# EasyEDA Pro project mt7621_integrated_router_v2.6_2025-04-17.epro, schematic Schematic1

## Sheets
1 PWR: Board Name: Board1; Create Date: 2025-03-22; Page Name: PWR; Project Name: mt7621_integrated_router; Schematic Name: Schematic1; Update Date: 2025-03-22; Company: 嘉立创EDA; Page Size: A4; Version: V1.0
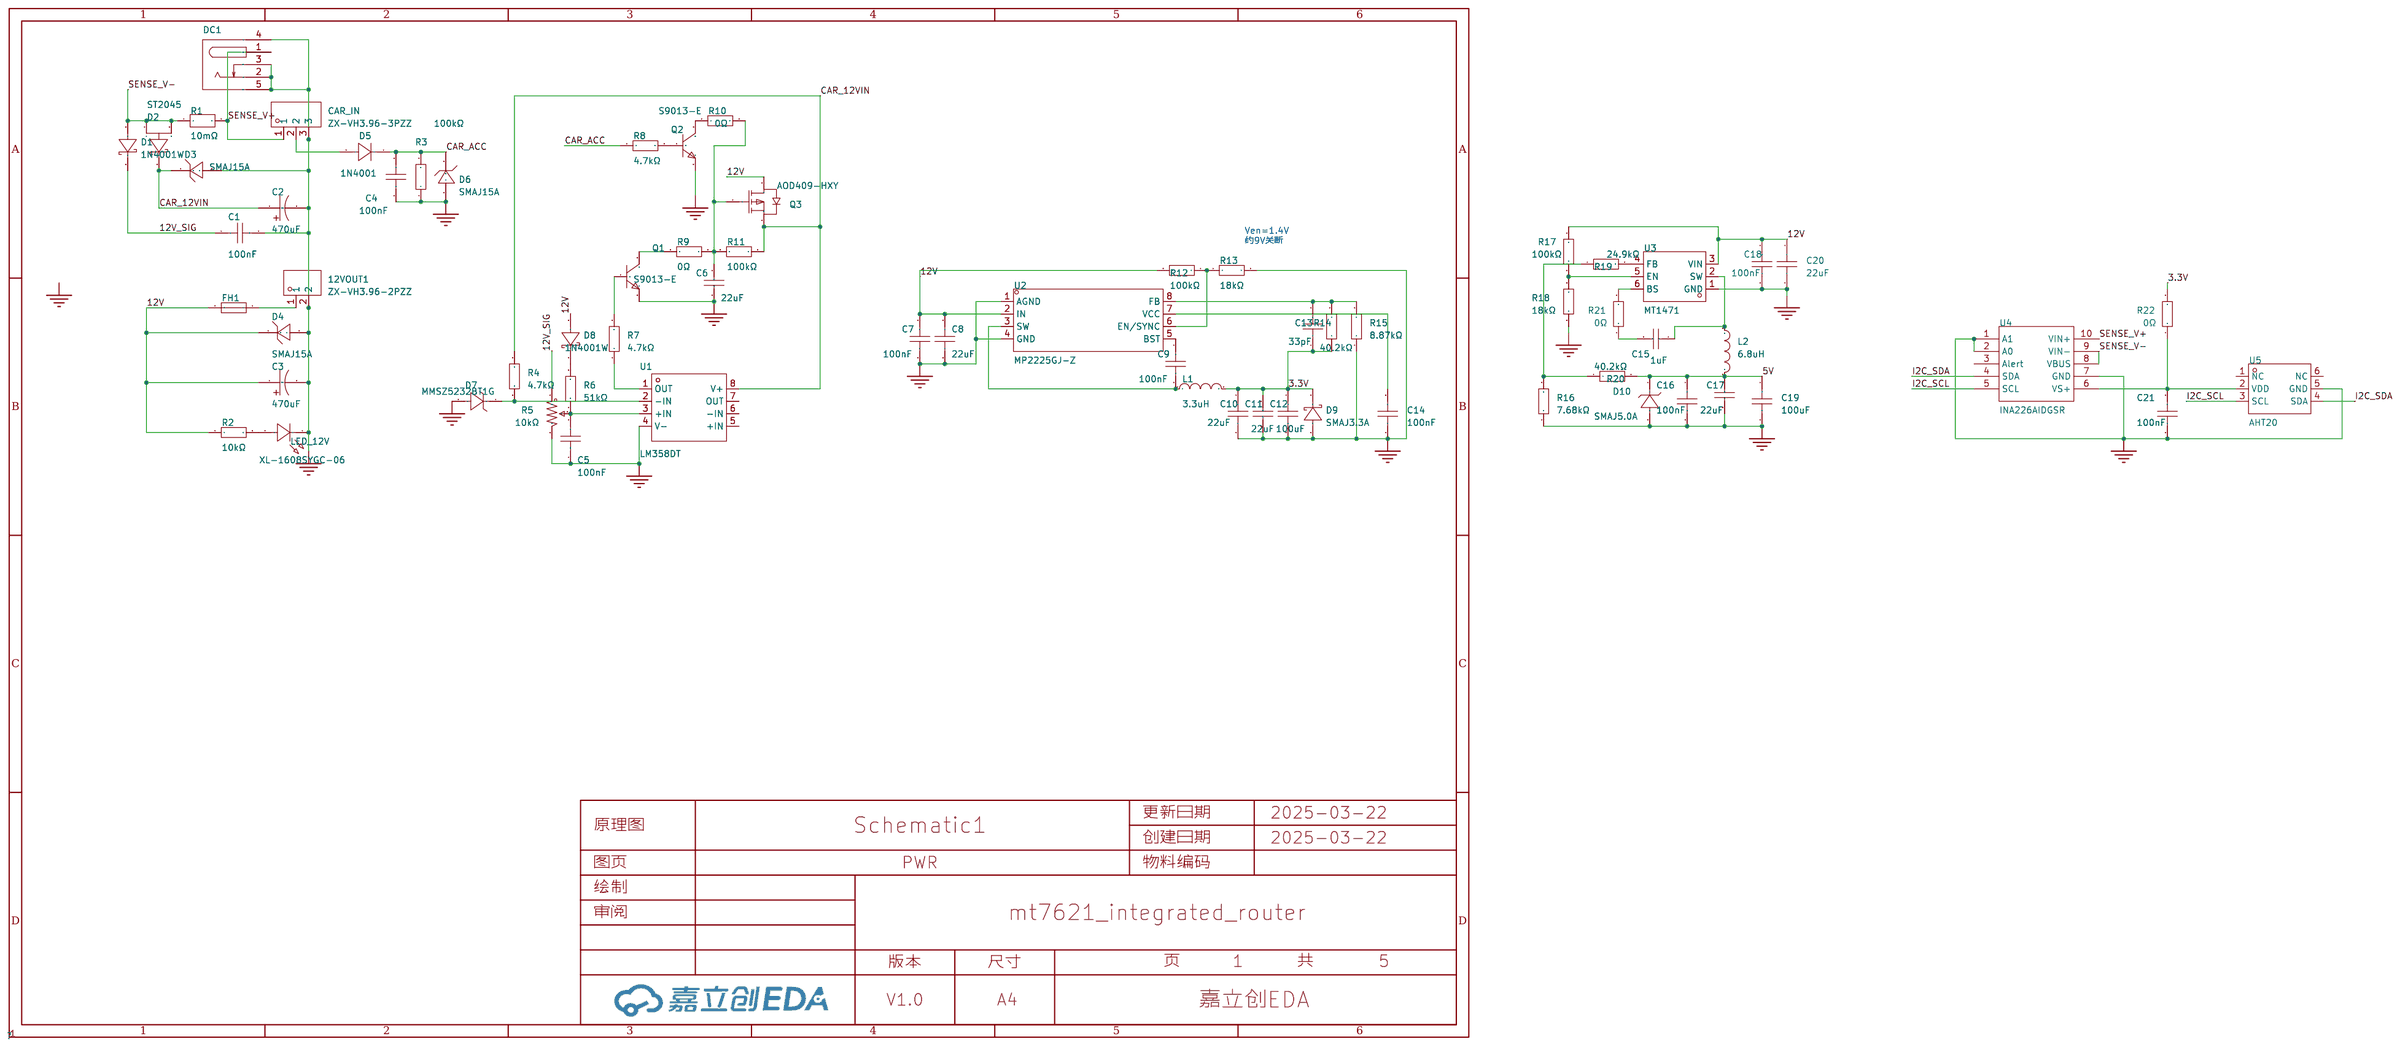
[diagram p0: PWR]
2 Router: Create Date: 2025-03-21; Page Name: Router; Update Date: 2025-03-21
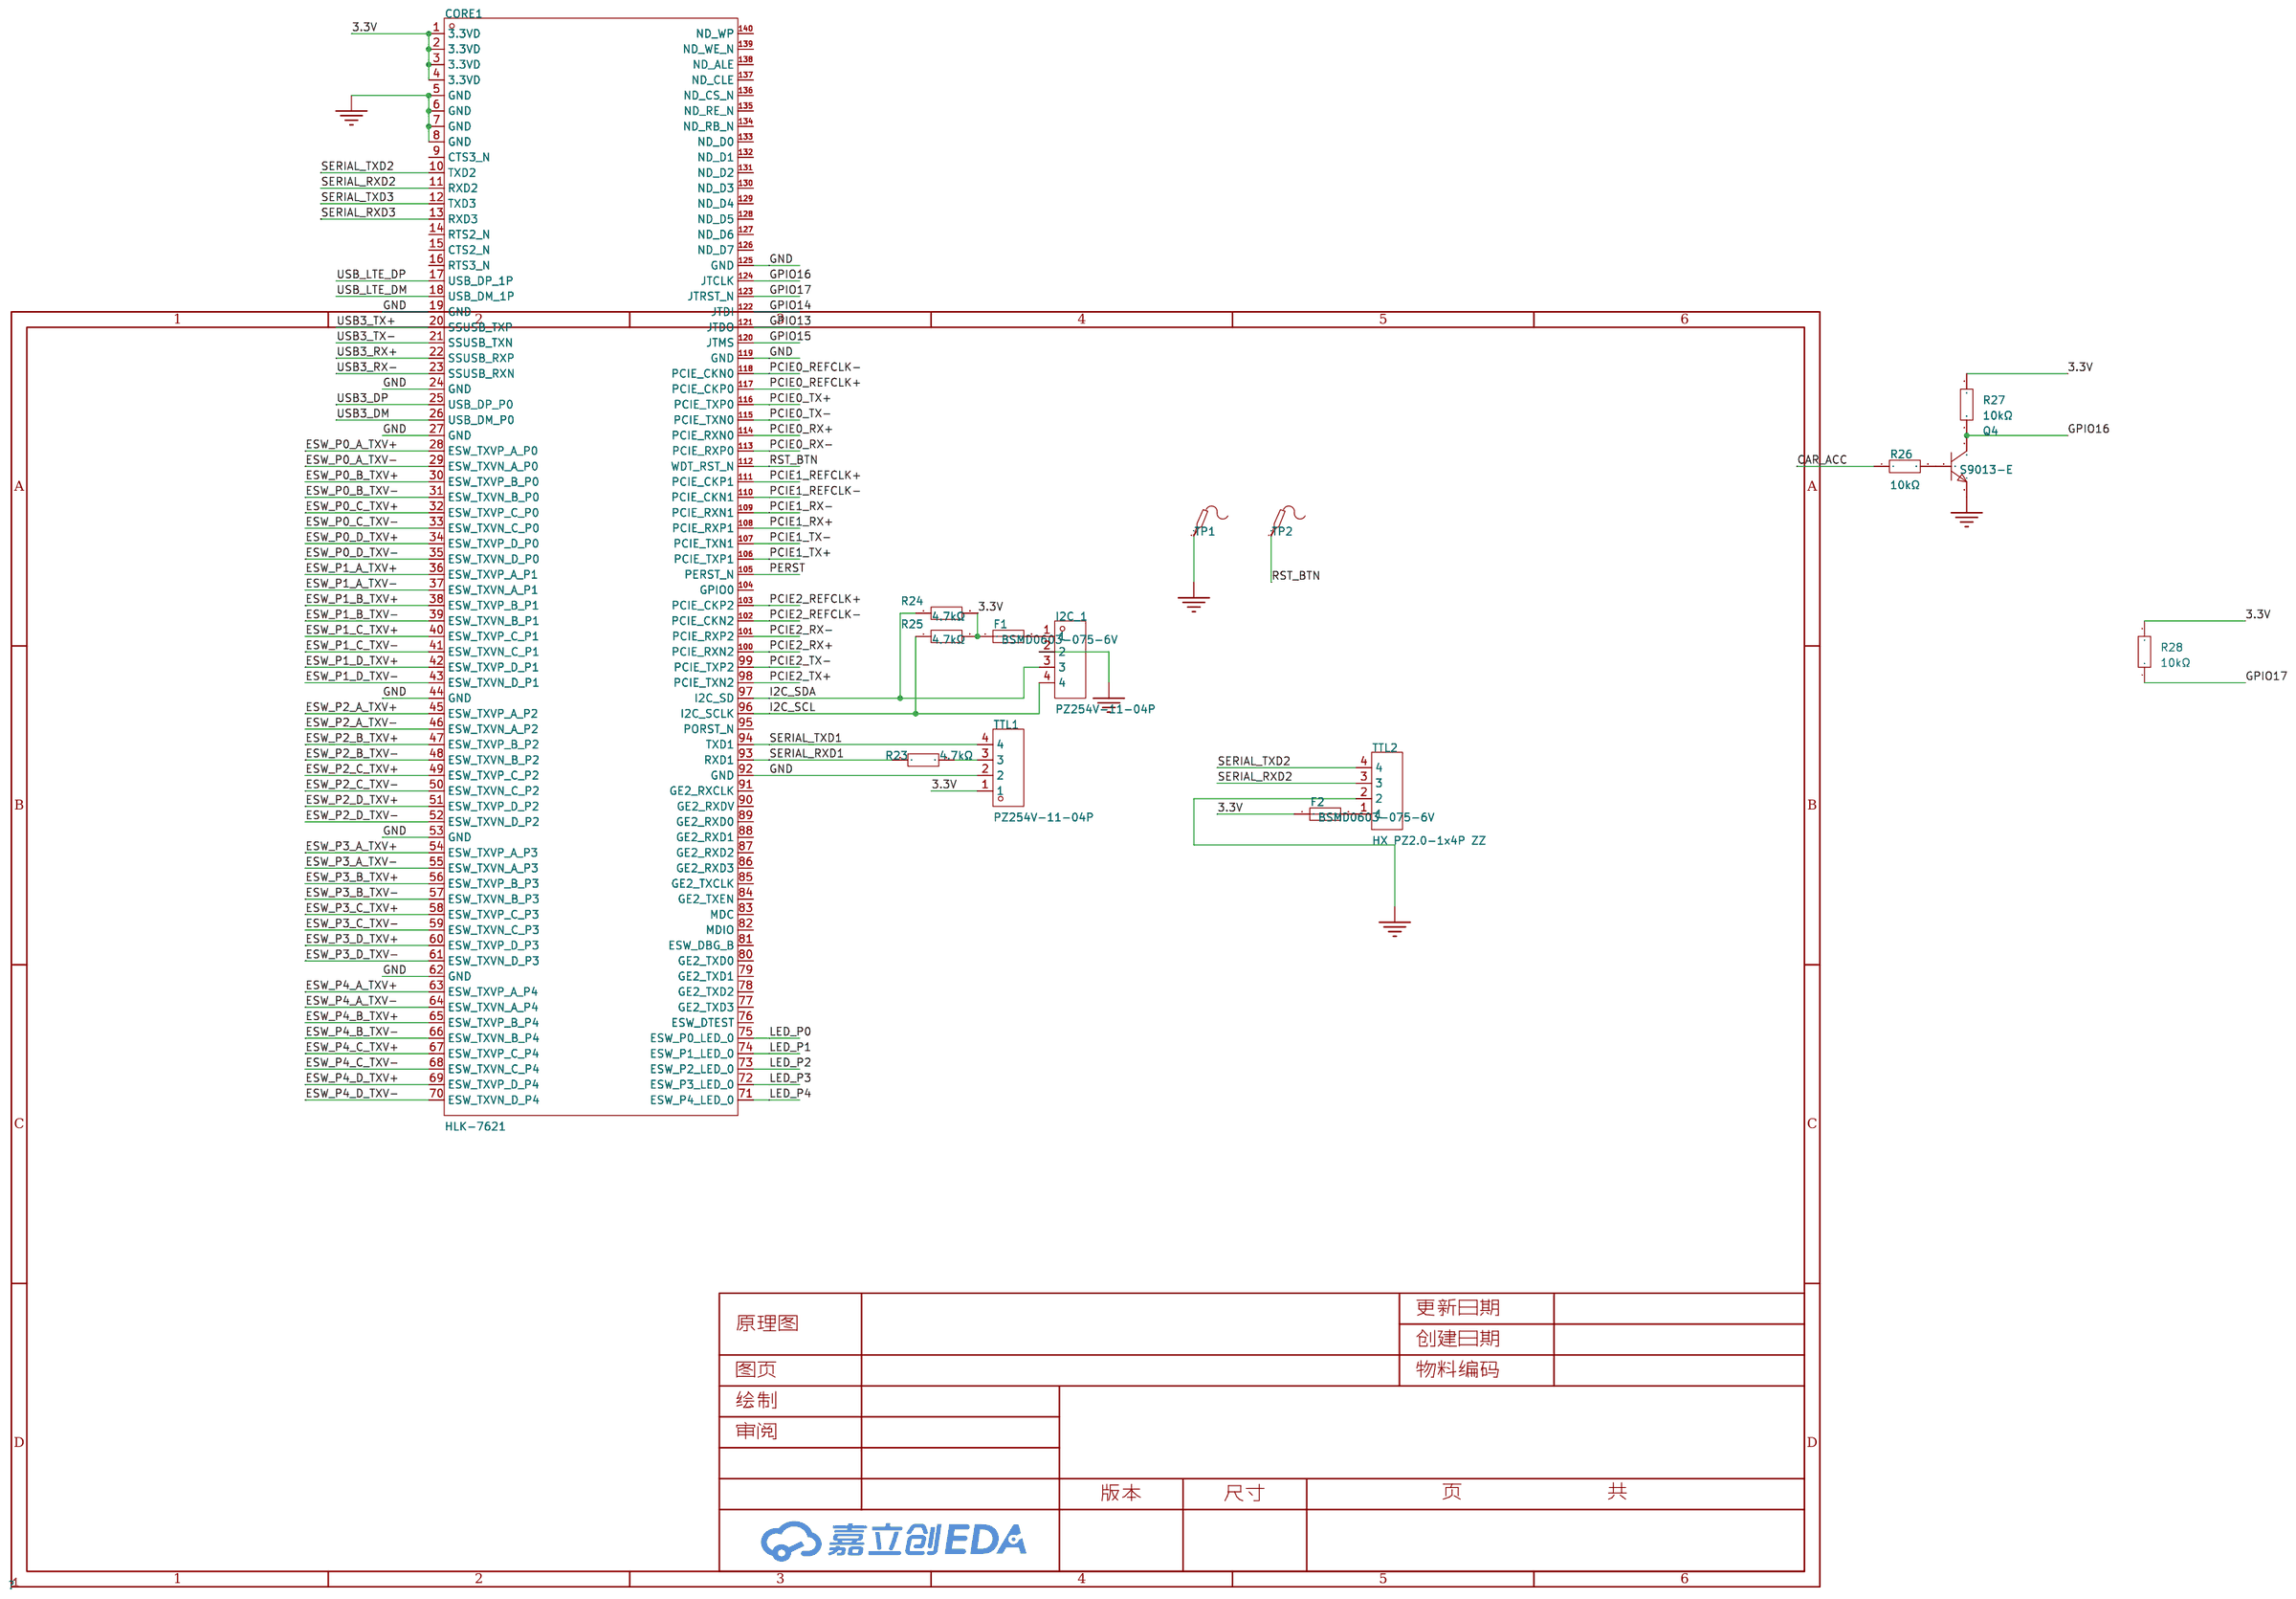
[diagram p1: Router]
3 PCIE: Create Date: 2025-02-01; Page Name: PCIE; Update Date: 2025-02-01
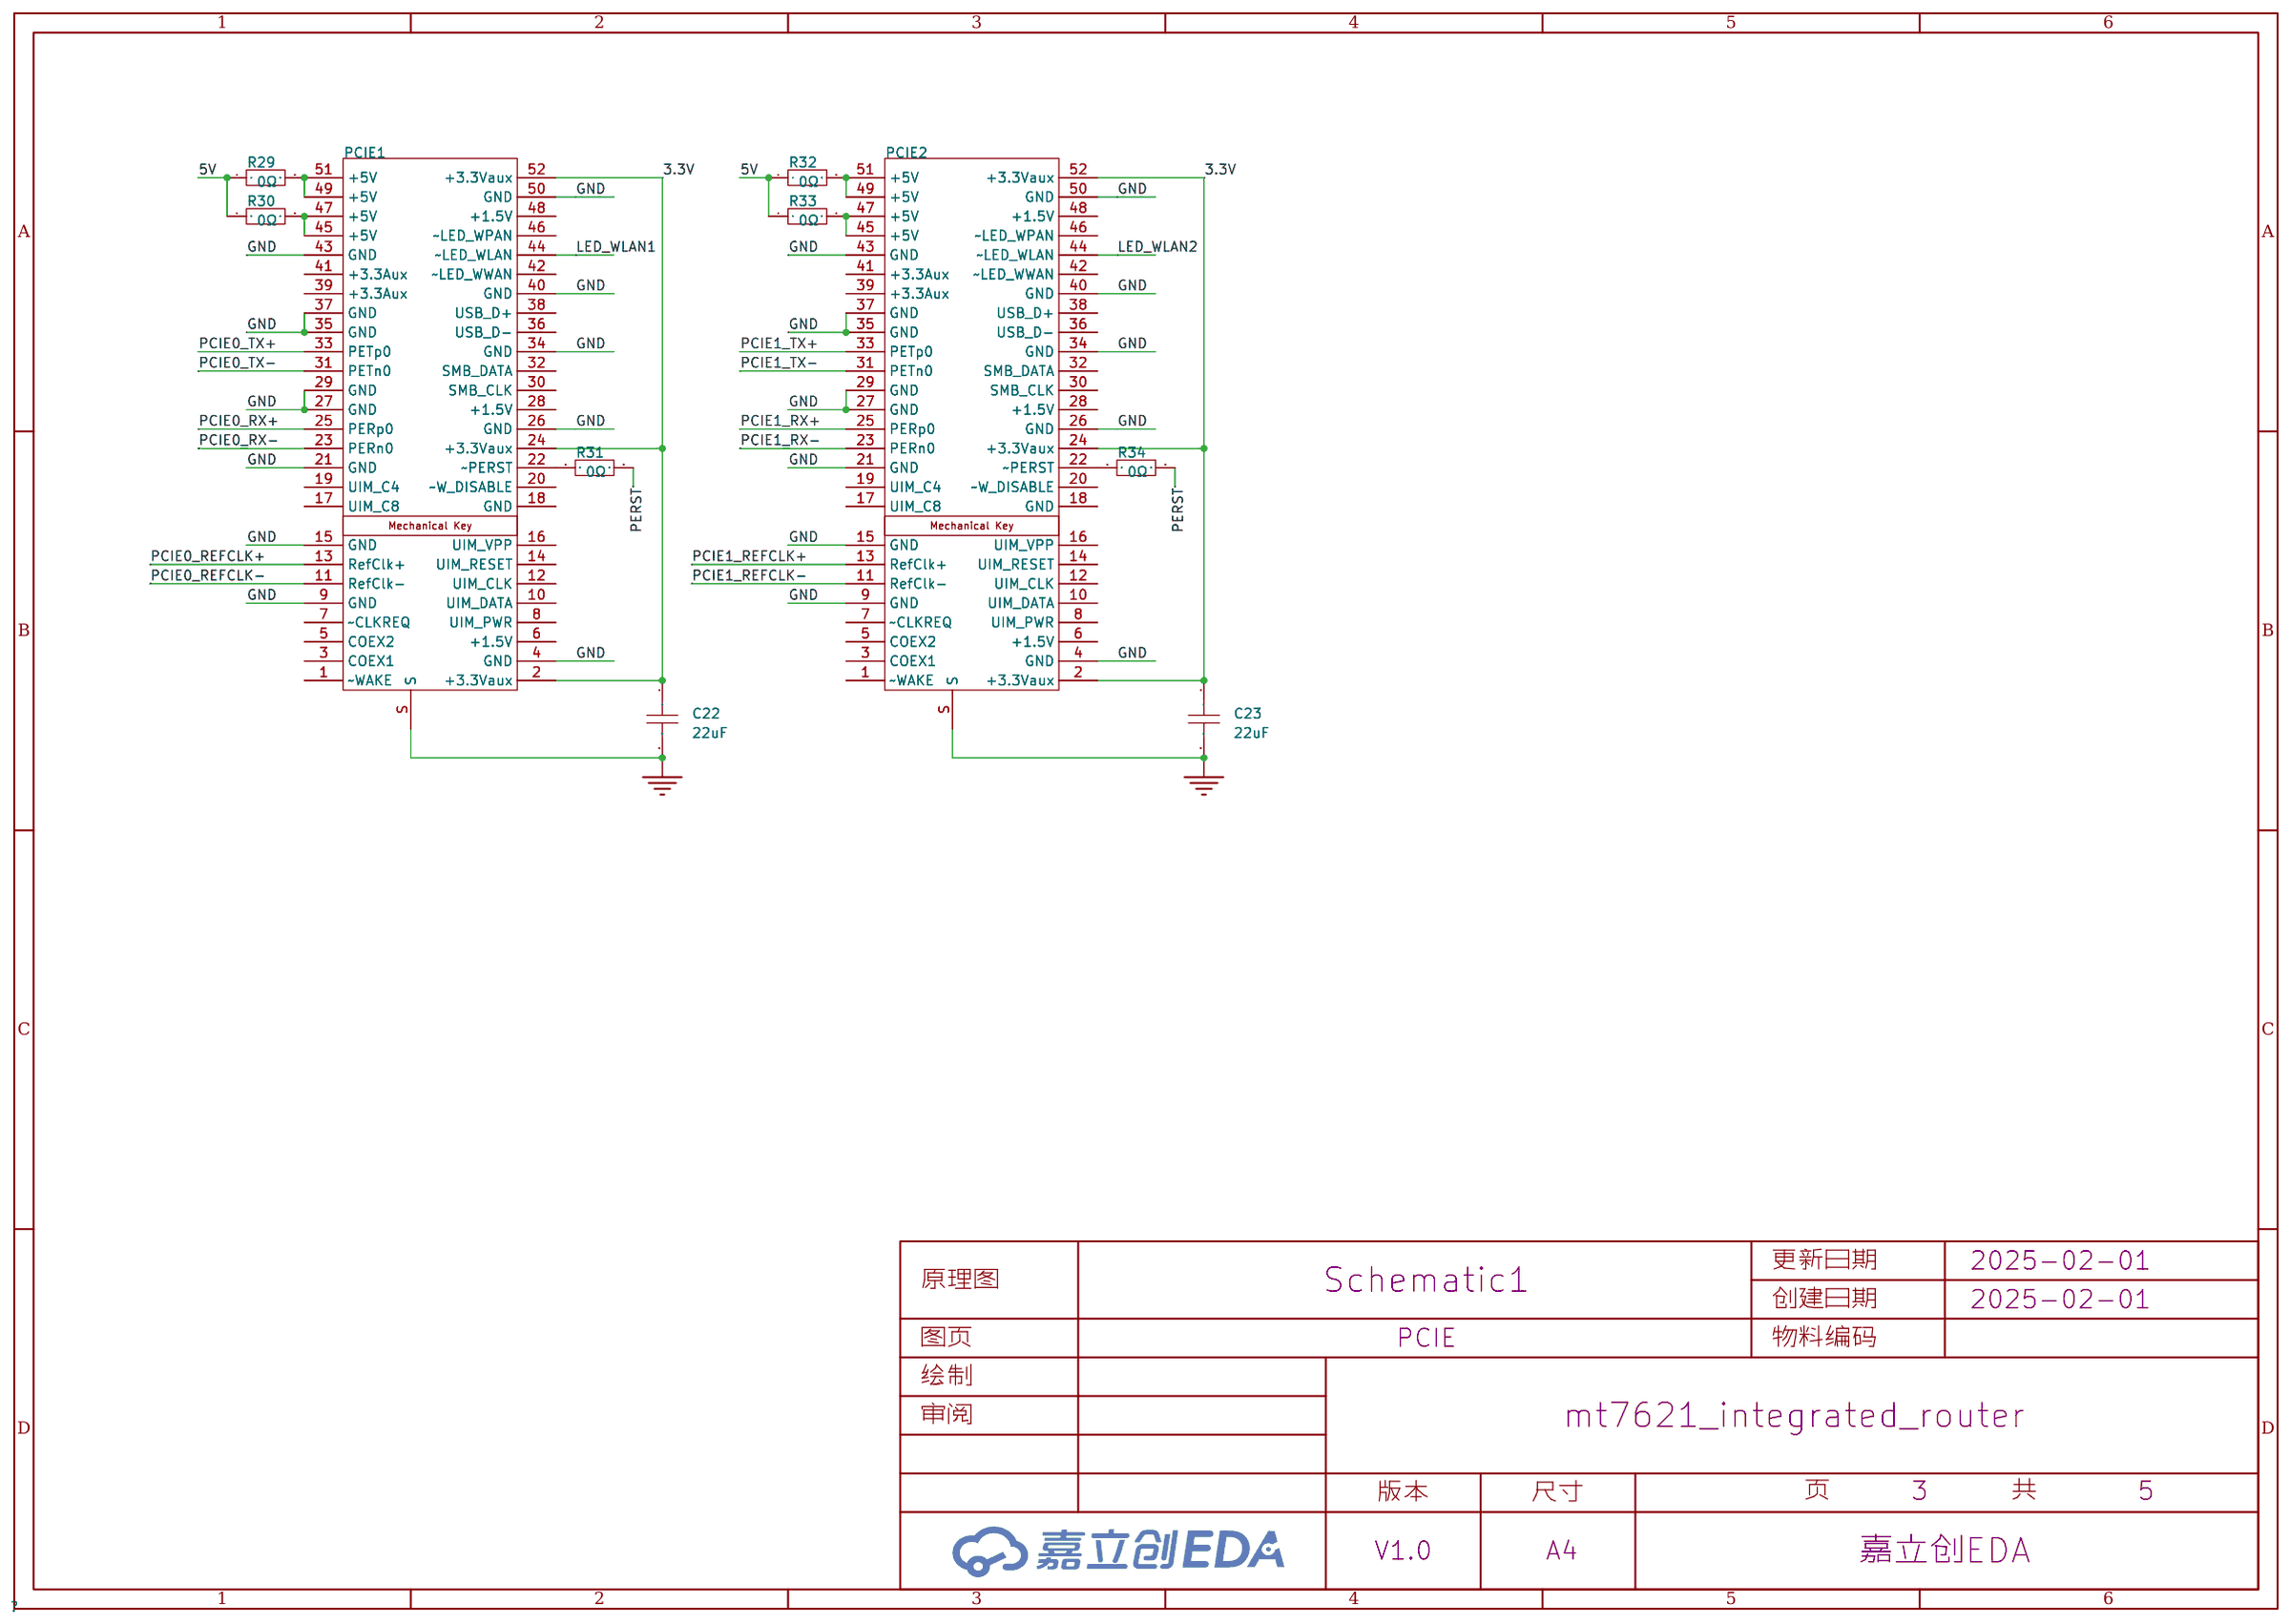
[diagram p2: PCIE]
4 LTE: Create Date: 2025-02-01; Page Name: LTE; Update Date: 2025-02-01
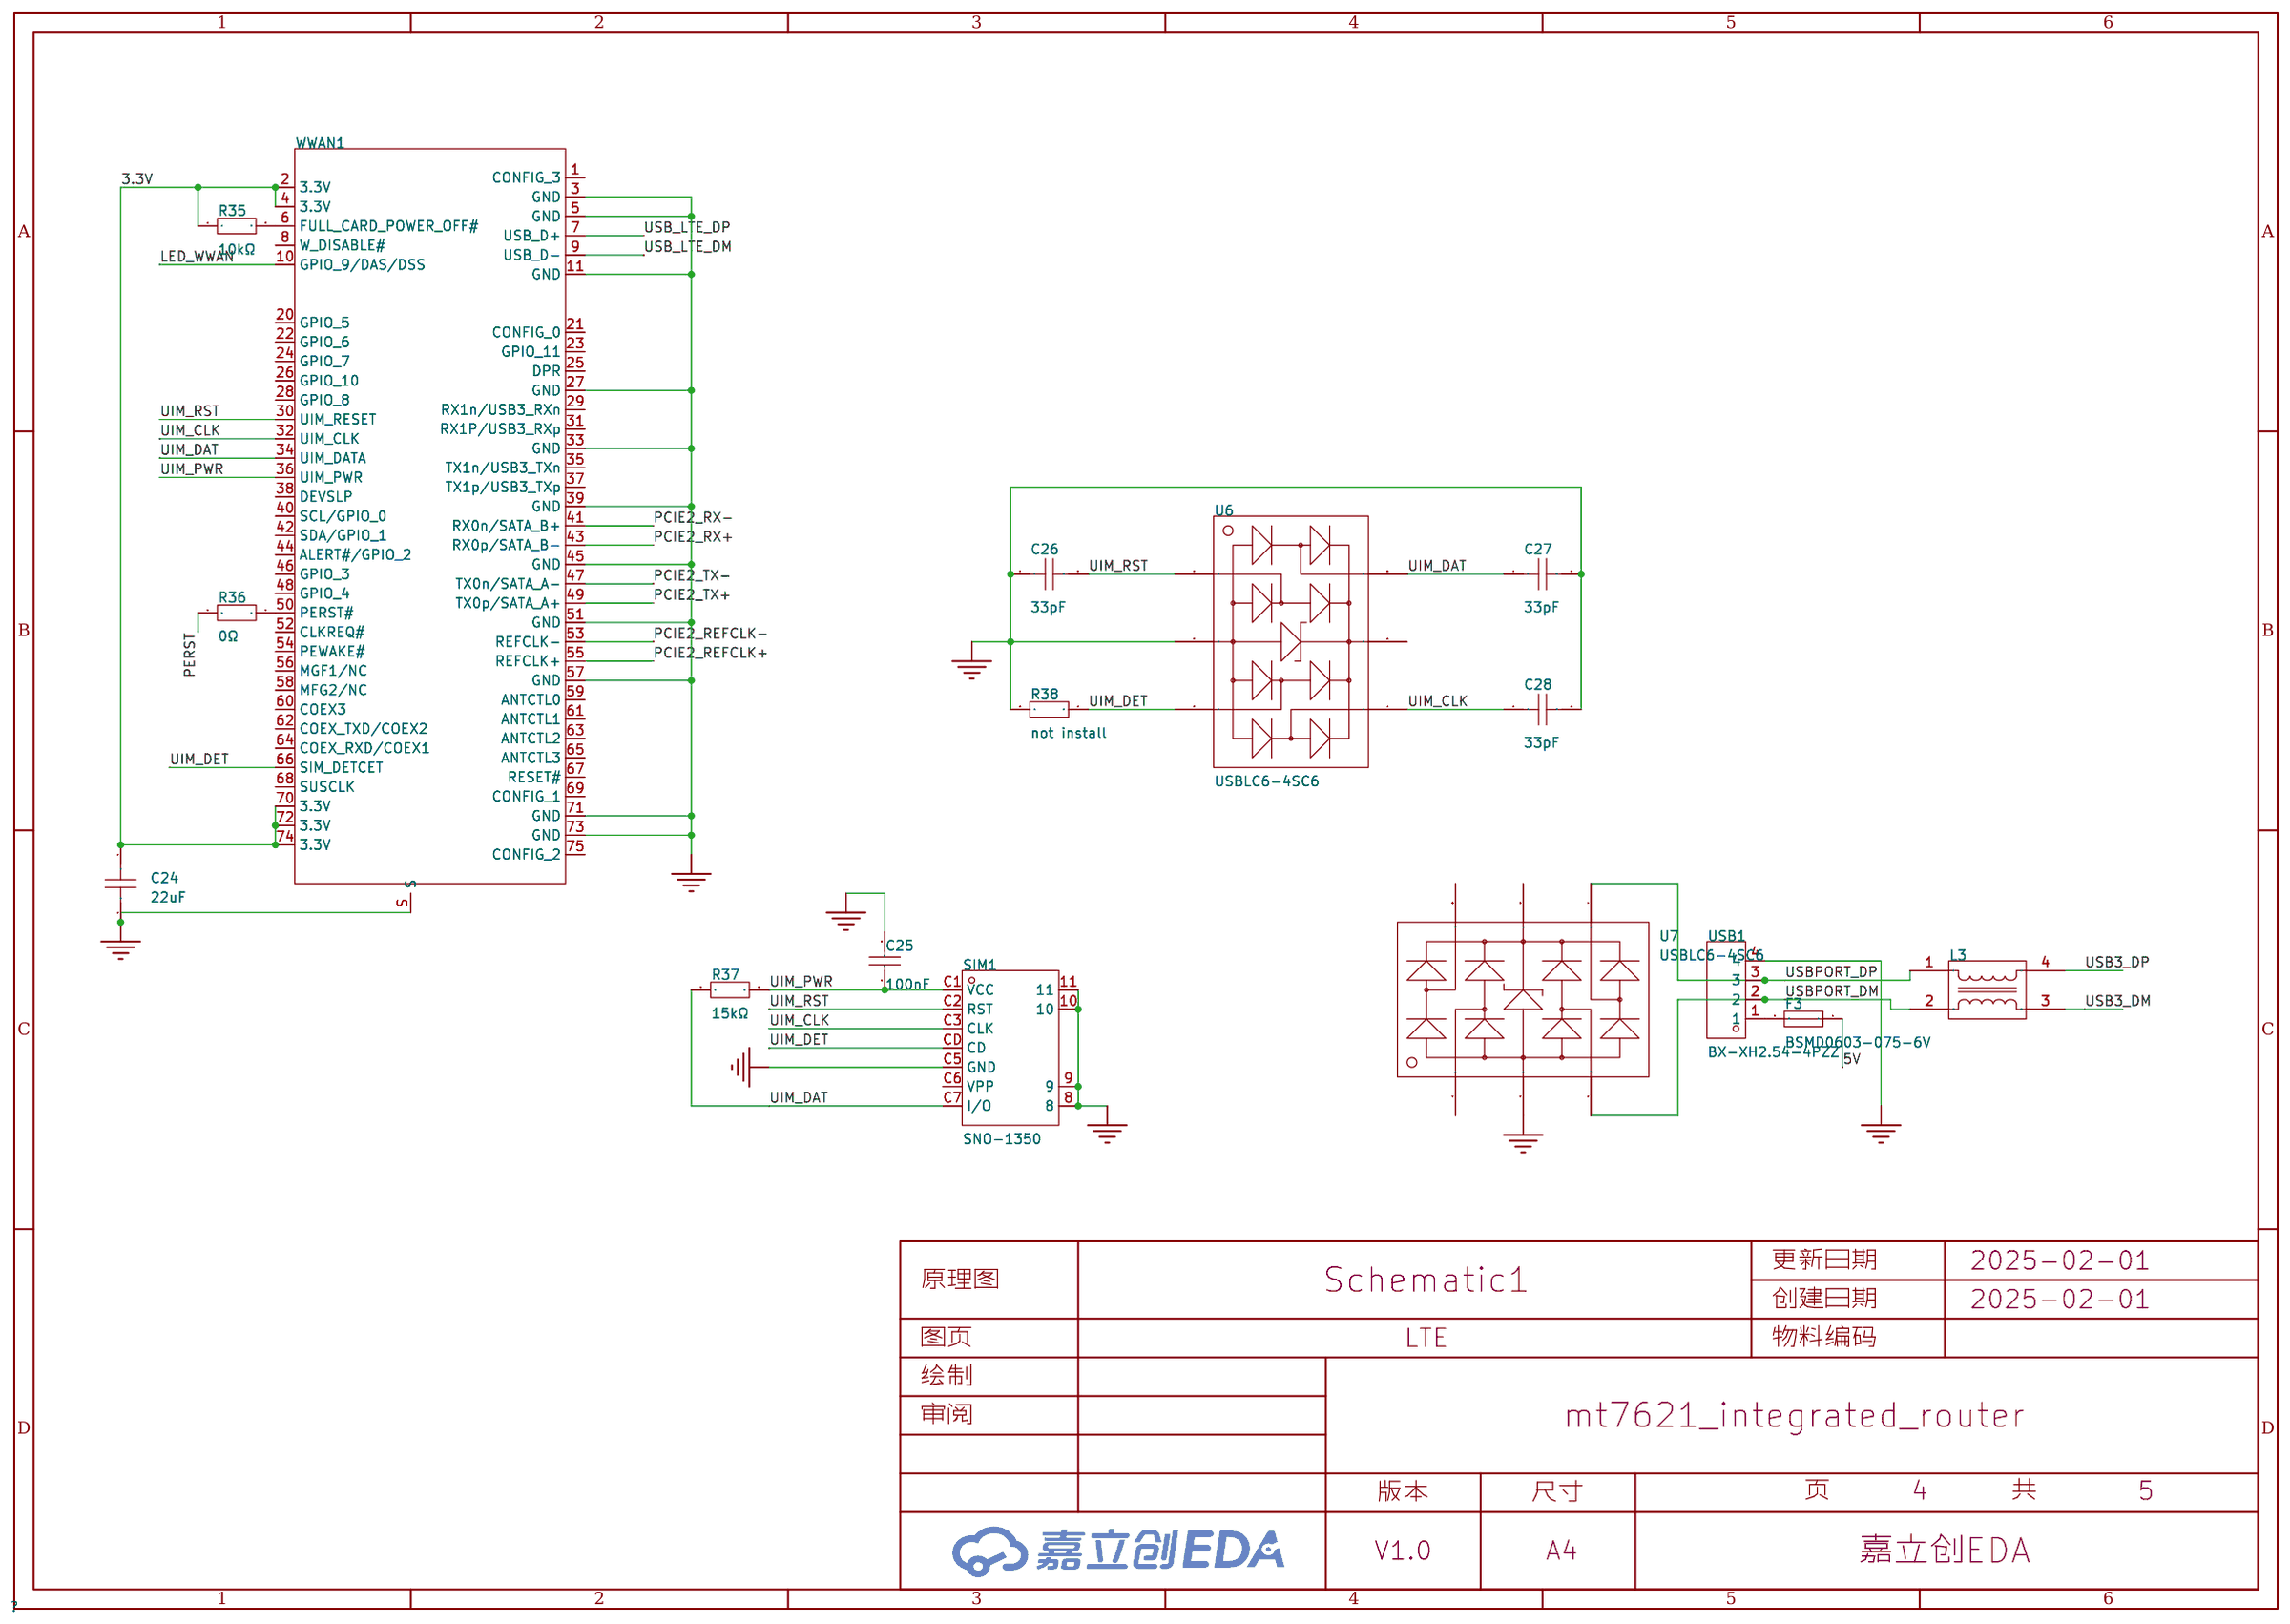
[diagram p3: LTE]
5 RJ45: Create Date: 2025-02-01; Page Name: RJ45; Update Date: 2025-03-17
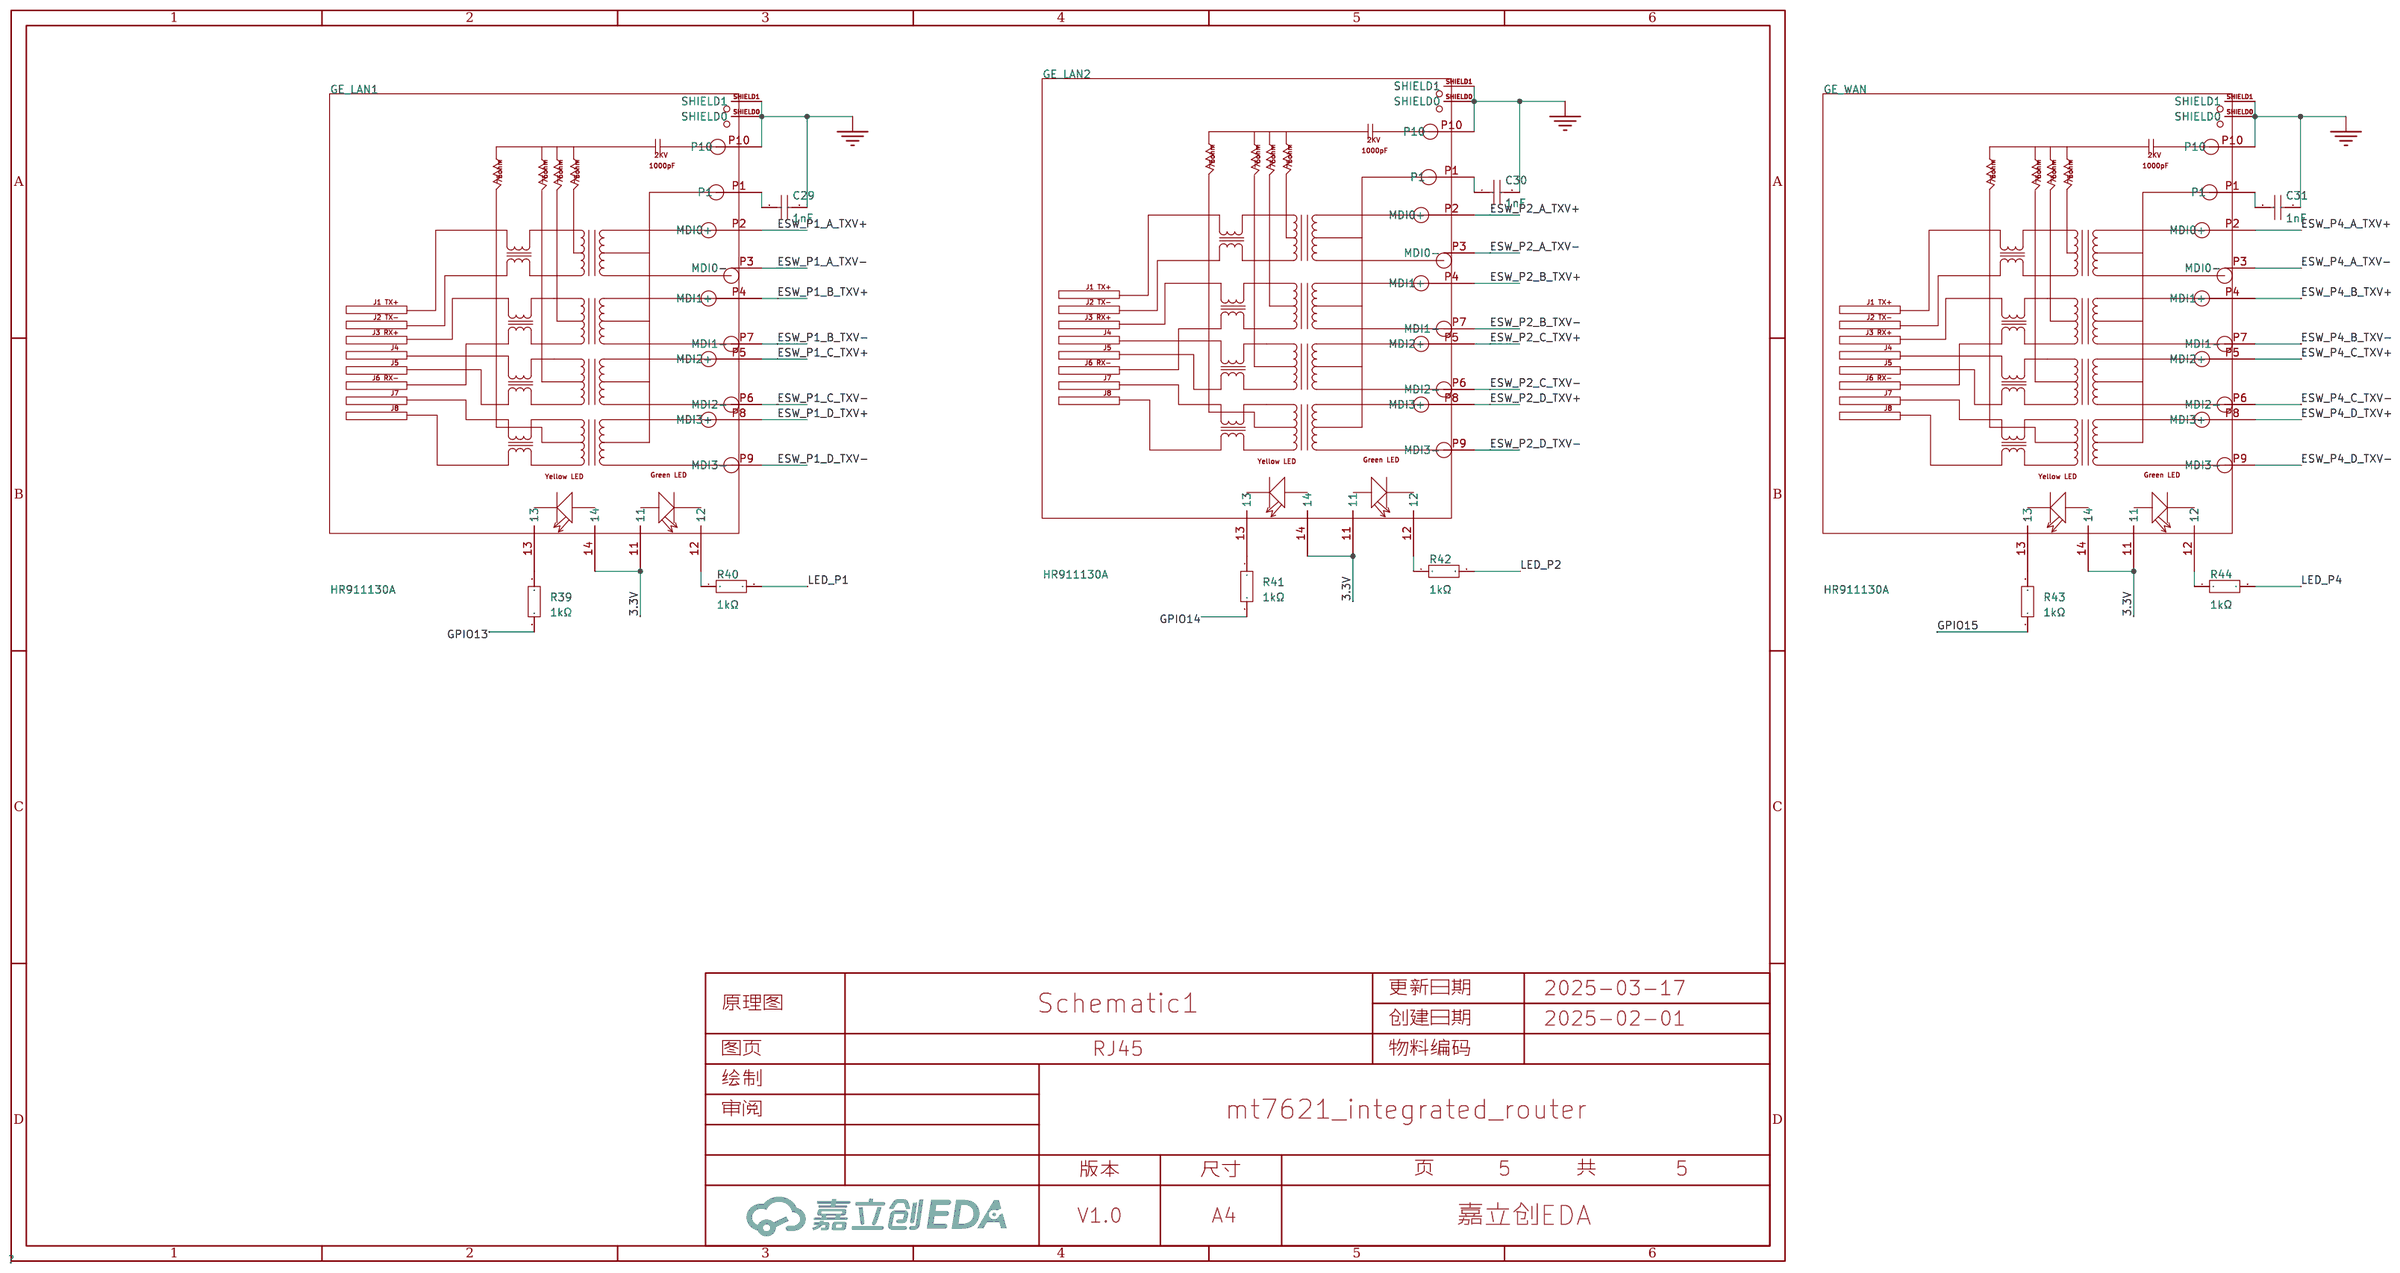
[diagram p4: RJ45]

## Parts
sheet LTE
C24  22uF  [C0805]
C25  100nF  [C0603]
C26  33pF  [C0603]
C27  33pF  [C0603]
C28  33pF  [C0603]
F3  BSMD0603-075-6V  [F0603]
L3  ACM2012-900-2P-T001  [FILTER-SMD_4P-L2.0-W1.2-TL_ACM2012E]
R35  10kΩ  [R0603]
R36  0Ω  [R0603]
R37  15kΩ  [R0603]
R38  not install  [R0603]
SIM1  SNO-1350  [SIM-SMD_SNO-1350]
U6  USBLC6-4SC6  [SOT-23-6_L2.9-W1.6-P0.95-LS2.8-BL]
U7  USBLC6-4SC6  [SOT-23-6_L2.9-W1.6-P0.95-LS2.8-BL]
USB1  BX-XH2.54-4PZZ  [CONN-TH_4P-P2.50_BX-XH2.54-4PZZ]
WWAN1  -  [NGFF_B_KEY_H3.2]
sheet PCIE
C22  22uF  [C0805]
C23  22uF  [C0805]
PCIE1  Mini-PCI-E_Socket_5V  [Mini_PCI-E_Socket]
PCIE2  Mini-PCI-E_Socket_5V  [Mini_PCI-E_Socket]
R29  0Ω  [R0603]
R30  0Ω  [R0603]
R31  0Ω  [R0603]
R32  0Ω  [R0603]
R33  0Ω  [R0603]
R34  0Ω  [R0603]
sheet PWR
12VOUT1  ZX-VH3.96-2PZZ  [CONN-TH_2P-P3.96_MEGASTAR_ZX-VH3.96-2PZZ]
C1  100nF  [C0603]
C2  470uF  [CAP-TH_BD8.0-P3.50-D0.6-FD]
C3  470uF  [CAP-TH_BD8.0-P3.50-D0.6-FD]
C4  100nF  [C0603]
C5  100nF  [C0603]
C6  22uF  [C0805]
C7  100nF  [C0603]
C8  22uF  [C0805]
C9  100nF  [C0603]
C10  22uF  [C0805]
C11  22uF  [C0805]
C12  100uF  [C1206]
C13  33pF  [C0603]
C14  100nF  [C0603]
C15  1uF  [C0603]
C16  100nF  [C0603]
C17  22uF  [C0805]
C18  100nF  [C0603]
C19  100uF  [C1206]
C20  22uF  [C0805]
C21  100nF  [C0603]
CAR_IN  ZX-VH3.96-3PZZ  [CONN-TH_3P-P3.96_MEGASTAR_ZX-VH3.96-3PZZ]
D1  1N4001W  [SOD-123FL_L2.7-W1.8-LS3.8-RD]
D2  ST2045  [TO-277_3P-L5.4-W4.0-LS6.5-BR]
D3  SMAJ15A  [SMA_L4.3-W2.6-LS5.2-RD]
D4  SMAJ15A  [SMA_L4.3-W2.6-LS5.2-RD]
D5  1N4001  [SMA_L4.3-W2.5-LS5.0-RD]
D6  SMAJ15A  [SMA_L4.3-W2.6-LS5.2-RD]
D7  MMSZ5232BT1G  [SOD-123_L2.7-W1.6-LS3.7-RD]
D8  1N4001W  [SOD-123FL_L2.7-W1.8-LS3.8-RD]
D9  SMAJ3.3A  [SMA-SMD_L4.4-W2.7-LS5.4-RD]
D10  SMAJ5.0A  [SMA_L4.3-W2.6-LS5.0-RD]
DC1  -  [DC-IN-TH_DC-044A-20A]
FH1  01550900M  [FUSE-SMD_L9.8-W5.0]
L1  3.3uH  [IND-SMD_L7.0-W6.6]
L2  6.8uH  [IND-SMD_L7.0-W6.6]
LED_12V  XL-1608SYGC-06  [LED0603-RD_GREEN]
Q1  S9013-E  [SOT-23-3_L2.9-W1.3-P1.90-LS2.4-BR]
Q2  S9013-E  [SOT-23-3_L2.9-W1.3-P1.90-LS2.4-BR]
Q3  AOD409-HXY  [TO-252-2_L6.6-W6.1-P4.57-LS9.9-TL-CW]
R1  10mΩ  [R1206]
R2  10kΩ  [R0603]
R3  100kΩ  [R0603]
R4  4.7kΩ  [R0603]
R5  10kΩ  [RES-ADJ-TH_3P-L10.0-W10.0-P2.50-L]
R6  51kΩ  [R0603]
R7  4.7kΩ  [R0603]
R8  4.7kΩ  [R0603]
R9  0Ω  [R0603]
R10  0Ω  [R0603]
R11  100kΩ  [R0603]
R12  100kΩ  [R0603]
R13  18kΩ  [R0603]
R14  40.2kΩ  [R0603]
R15  8.87kΩ  [R0603]
R16  7.68kΩ  [R0603]
R17  100kΩ  [R0603]
R18  18kΩ  [R0603]
R19  24.9kΩ  [R0603]
R20  40.2kΩ  [R0603]
R21  0Ω  [R0603]
R22  0Ω  [R0603]
U1  LM358DT  [SOIC-8_L5.0-W4.0-P1.27-LS6.0-BL]
U2  MP2225GJ-Z  [TSOT-23-8_L2.9-W1.6-P0.65-LS2.8-BR]
U3  MT1471  [SOT-23-6_L2.9-W1.6-P0.95-LS2.8-BR]
U4  INA226AIDGSR  [MSOP-10_L3.0-W3.0-P0.50-LS5.0-BL]
U5  AHT20  [SENSOR-SMD_L3.0-W3.0-P1.00-BR]
sheet RJ45
C29  1nF  [C0603]
C30  1nF  [C0603]
C31  1nF  [C0603]
GE_LAN1  HR911130A  [RJ45-TH_HR911130A]
GE_LAN2  HR911130A  [RJ45-TH_HR911130A]
GE_WAN  HR911130A  [RJ45-TH_HR911130A]
R39  1kΩ  [R0603]
R40  1kΩ  [R0603]
R41  1kΩ  [R0603]
R42  1kΩ  [R0603]
R43  1kΩ  [R0603]
R44  1kΩ  [R0603]
sheet Router
CORE1  HLK-7621  [COMM-SMD_HLK-7621]
F1  BSMD0603-075-6V  [F0603]
F2  BSMD0603-075-6V  [F0603]
I2C_1  PZ254V-11-04P  [HDR-TH_4P-P2.54-V-M]
Q4  S9013-E  [SOT-23-3_L2.9-W1.3-P1.90-LS2.4-BR]
R23  4.7kΩ  [R0603]
R24  4.7kΩ  [R0603]
R25  4.7kΩ  [R0603]
R26  10kΩ  [R0603]
R27  10kΩ  [R0603]
R28  10kΩ  [R0603]
TP1  -  [Test-Point-0.5mm]
TP2  -  [Test-Point-0.5mm]
TTL1  PZ254V-11-04P  [HDR-TH_4P-P2.54-V-M]
TTL2  HX PZ2.0-1x4P ZZ  [HDR-TH_4P-P2.00-V-M-3]

## Library data of the parts
C6 C8 C10 C11 C17 C20 C22-C24 = CC0805MKX5R7BB226: 容值:22uF;精度:±20%;额定电压:16V;材质(温度系数):X5R;; LCSC Part Name: 22uF ±20% 16V; Supplier Part: C128856; Manufacturer: YAGEO(国巨); Supplier Footprint: 0805; JLCPCB Part Class: Extended Part; Datasheet: https://atta.szlcsc.com/upload/public/pdf/source/20200619/C128856_2FCFBA051414242A35F1817523308144.pdf; Supplier: LCSC; Tolerance: ±20%; Voltage Rated: 16V; Temperature Coefficient: X5R
C7 C9 C16 C18 C21 C25 = CL10B104KA8NNNC: 容值:100nF;精度:±10%;额定电压:25V;材质(温度系数):X7R;; LCSC Part Name: 100nF ±10% 25V; Supplier Part: C1590; Manufacturer: SAMSUNG(三星); Supplier Footprint: 0603; JLCPCB Part Class: Extended Part; Datasheet: https://atta.szlcsc.com/upload/public/pdf/source/20160103/1457707680294.pdf; Supplier: LCSC; Tolerance: ±10%; Voltage Rated: 25V; Temperature Coefficient: X7R
C13 C26-C28 = 0603CG330J500NT: 容值:33pF;精度:±5%;额定电压:50V;材质(温度系数):C0G;; LCSC Part Name: 33pF ±5% 50V; Supplier Part: C91368; Manufacturer: FH(风华); Supplier Footprint: 0603; JLCPCB Part Class: 扩展库; Datasheet: https://atta.szlcsc.com/upload/public/pdf/source/20170923/C91368_1506149566728988976.pdf; Supplier: LCSC; Tolerance: ±5%; Voltage Rated: 50V; Temperature Coefficient: C0G
F1-F3 = BSMD0603-075-6V: 最大电压:6V;最大电流:40A;保持电流:750mA;跳闸电流:1.5A;; LCSC Part Name: 6V 750mA 0603自恢复; Supplier Part: C914092; Manufacturer: BHFUSE(佰宏); Supplier Footprint: 0603; JLCPCB Part Class: Extended Part; Datasheet: https://atta.szlcsc.com/upload/public/pdf/source/20230512/E478DE3555A0061DA0124A9F45802B86.pdf; Supplier: LCSC; Operating Voltage (Max): 6V; Current Rating (Max): 40A; Hold Current: 750mA; Trip Current: 1.5A; Power Dissipation: 500mW; Resistance - Initial (Ri) (Min): 60mΩ; Resistance - Post Trip (R1) (Max): 450mΩ; Maximum Time to Trip: 100ms; Operating Temperature: -40℃~+85℃
L3 = ACM2012-900-2P-T001: 线路数:2;阻抗 @ 频率:90Ω@100MHz;直流电阻(DCR):190mΩ;; LCSC Part Name: 两路 贴片共模滤波器 阻抗90Ω@100MHz; Supplier Part: C307642; Manufacturer: TDK; Supplier Footprint: SMD,2X1.2x1.3mm; JLCPCB Part Class: 扩展库; Datasheet: https://atta.szlcsc.com/upload/public/pdf/source/20190722/C404375_4B4DF30A3263EFA7EC5B48E25B1E7F7A.pdf; Supplier: LCSC; Number of Lines: 2; Withstanding Voltage: 600V; Current Rating: 400mA; Voltage Rating - DC: 50V; Impedance @ Frequency: 90Ω@100MHz; DC Resistance (DCR): 190mΩ; Operating Temperature: -40℃~+105℃
R2 R26-R28 R35 = 0603WAF1002T5E: 电阻类型:厚膜电阻;阻值:10kΩ;精度:±1%;功率:100mW;; LCSC Part Name: 厚膜电阻 10kΩ ±1% 100mW; Supplier Part: C25804; Manufacturer: UNI-ROYAL(厚声); Supplier Footprint: 0603; JLCPCB Part Class: 基础库; Datasheet: https://atta.szlcsc.com/upload/public/pdf/source/20200306/C422600_1E6D84923E4A46A82E41ADD87F860B5C.pdf; Supplier: LCSC; Type: 厚膜电阻; Tolerance: ±1%; Power(Watts): 100mW; Temperature Coefficient: ±100ppm/℃; Overload Voltage (Max): 75V; Operating Temperature Range: -55℃~+155℃
R9 R10 R21 R22 R29-R34 R36 = 0603WAF0000T5E: 电阻类型:厚膜电阻;阻值:0Ω;精度:±1%;功率:100mW;; LCSC Part Name: 0Ω ±1% 100mW; Supplier Part: C21189; Manufacturer: UNI-ROYAL(厚声); Supplier Footprint: 0603; JLCPCB Part Class: 基础库; Datasheet: https://atta.szlcsc.com/upload/public/pdf/source/20200306/C422600_1E6D84923E4A46A82E41ADD87F860B5C.pdf; Supplier: LCSC; Type: 厚膜电阻; Tolerance: ±1%; Power(Watts): 100mW; Overload Voltage (Max): 75V; Operating Temperature Range: -55℃~+155℃
R37 = AC0603FR-0715KL: 电阻类型:厚膜电阻;阻值:15kΩ;精度:±1%;功率:100mW;; LCSC Part Name: 15kΩ ±1% 100mW; Supplier Part: C125928; Manufacturer: YAGEO(国巨); Supplier Footprint: 0603; JLCPCB Part Class: 扩展库; Datasheet: https://atta.szlcsc.com/upload/public/pdf/source/20171221/C125928_15138310091971195203.pdf; Supplier: LCSC; Type: 厚膜电阻; Tolerance: ±1%; Power(Watts): 100mW; Temperature Coefficient: ±100ppm/℃; Overload Voltage (Max): 75V; Operating Temperature Range: -55℃~+155℃
R38 = RC0603FR-0733KL: 电阻类型:厚膜电阻;阻值:33kΩ;精度:±1%;功率:100mW;; LCSC Part Name: 33kΩ ±1% 100mW; Supplier Part: C126359; Manufacturer: YAGEO(国巨); Supplier Footprint: 0603; JLCPCB Part Class: 扩展库; Datasheet: https://atta.szlcsc.com/upload/public/pdf/source/20170818/C126359_1503051263039895297.pdf; Supplier: LCSC; Type: 厚膜电阻; Tolerance: ±1%; Power(Watts): 100mW; Temperature Coefficient: ±100ppm/℃; Overload Voltage (Max): 75V; Operating Temperature Range: -55℃~+155℃
SIM1 = SNO-1350: 触头材质:-;卡连接方式:-;触头镀层:-;连接器类型:-;卡类型:-;; Supplier Part: C410358; Manufacturer: HANBO(汉博); Supplier Footprint: SMD; JLCPCB Part Class: 扩展库; Datasheet: https://atta.szlcsc.com/upload/public/pdf/source/20210810/0F59696A76593C5ED7E633075788D5BB.pdf; Supplier: LCSC
U6 U7 = USBLC6-4SC6_C5197386: Supplier Part: C5197386; Manufacturer: TECH PUBLIC(台舟); Supplier Footprint: SOT-23-6; JLCPCB Part Class: 扩展库; Datasheet: https://atta.szlcsc.com/upload/public/pdf/source/20221013/DA7C9D2E1699C4B4277AD0F5036C296E.pdf; Supplier: LCSC
USB1 = BX-XH2.54-4PZZ: 插针结构:1x4P;间距:2.54mm;安装方式:直插;参考系列:XH;总PIN数:4P;排数:1;每排PIN数:4;行距:-;额定电流:3A;触头材质:黄铜;触头镀层:锡;工作温度范围:-25℃~+85℃;; Supplier Part: C18077835; Manufacturer: Bossie(博锡); Supplier Footprint: 插件,P=2.54mm; JLCPCB Part Class: 扩展库; Datasheet: https://atta.szlcsc.com/upload/public/pdf/source/20231017/5821079C87ACB6AB664C681F6F628D03.pdf; Supplier: LCSC; Pins Structure: 1x4P; Pitch: 2.54mm; Mounting Style: 直插; Reference Series: XH; Number of Pins: 4P; Number of Rows: 1; Number of PINs Per Row: 4; Current Rating (Max): 3A; Contact Material: 黄铜; Contact Plating: 锡; Operating Temperature Range: -25℃~+85℃
WWAN1 = NGFF_B_KEY_H3.2: Check: false
PCIE1 PCIE2 = Mini-PCI-E_Socket_5V
12VOUT1 = ZX-VH3.96-2PZZ: 插针结构:1x2P;间距:3.96mm;安装方式:直插;参考系列:VH;总PIN数:2P;排数:1;每排PIN数:2;行距:-;额定电流:3A;触头材质:黄铜;触头镀层:锡;工作温度范围:-;; LCSC Part Name: 1x2P 间距:3.96mm 直插 系列:VH; Supplier Part: C7429660; Manufacturer: Megastar(兆星); Supplier Footprint: 插件,P=3.96mm; JLCPCB Part Class: 扩展库; Datasheet: https://atta.szlcsc.com/upload/public/pdf/source/20230619/B0F65C0388219DF8CB89B38B943D83C5.pdf; Supplier: LCSC; Pins Structure: 1x2P; Pitch: 3.96mm; Mounting Type: 直插; Reference Series: VH; Number of Pins: 2P; Number of Rows: 1; Number of PINs Per Row: 2; Current Rating: 3A; Contact Material: 黄铜; Contact Plating: 锡; Voltage Rating: 250V; Plastic Material: PA66; Flame Retardant Rating: UL94V-0; Color: 白色; X-Length of Bottom Edge on Board (Spacing Line): 7.92mm; Y-Width of Bottom Edge on Board: 7.9mm
C1 C4 C5 = CL10B104KA8NNNC: 容值:100nF;精度:±10%;额定电压:25V;材质(温度系数):X7R;; LCSC Part Name: 100nF ±10% 25V; Supplier Part: C1590; Manufacturer: SAMSUNG(三星); Supplier Footprint: 0603; JLCPCB Part Class: 扩展库; Datasheet: https://atta.szlcsc.com/upload/public/pdf/source/20160103/1457707680294.pdf; Supplier: LCSC; Tolerance: ±10%; Voltage Rated: 25V; Temperature Coefficient: X7R
C2 C3 = 16SEPG470M: 类型:聚合物;容值:470uF;精度:±20%;额定电压:16V;纹波电流:5.4A@100kHz;等效串联电阻:8mΩ@100kHz;; LCSC Part Name: 470uF±20%16V; Supplier Part: C403795; Manufacturer: PANASONIC(松下); Supplier Footprint: 插件,8x8.9mm; JLCPCB Part Class: ExtendedPart; Datasheet: https://atta.szlcsc.com/upload/public/pdf/source/20190712/C403795_C9CFFC89EE1BDDAC56CB480764CE2283.pdf; Supplier: LCSC; Type: 聚合物; Tolerance: ±20%; Rated Voltage: 16V; φD: 8mm; L: 8.9mm; Lead Spacing: 3.5mm; Ripple Current: 5.4A@100kHz; Equivalent Series Resistance(ESR): 8mΩ@100kHz; Lifetime @ Temp: 5000hrs@105℃; Operating Temperature: -55℃~+105℃
C12 C19 = GRM31CR61A107ME05L: 容值:100uF;精度:±20%;额定电压:10V;材质(温度系数):X5R;; LCSC Part Name: 100uF ±20% 10V; Supplier Part: C312983; Manufacturer: muRata(村田); Supplier Footprint: 1206; JLCPCB Part Class: Extended Part; Datasheet: https://atta.szlcsc.com/upload/public/pdf/source/20181029/C312983_F99DFC7E8AF2C04CC95A01A8A93C8DA6.pdf; Supplier: LCSC; Tolerance: ±20%; Voltage Rated: 10V; Temperature Coefficient: X5R; Rated Voltage: 6.3V; Equivalent Series Resistance(ESR): 500mΩ@100kHz; Operating Temperature: -55℃~+125℃
C14 = CL10B104KB8NNNC: 容值:100nF;精度:±10%;额定电压:50V;材质(温度系数):X7R;; LCSC Part Name: 100nF ±10% 50V; Supplier Part: C1591; Manufacturer: SAMSUNG(三星); Supplier Footprint: 0603; JLCPCB Part Class: 扩展库; Datasheet: https://atta.szlcsc.com/upload/public/pdf/source/20160218/1457707763339.pdf; Supplier: LCSC; Tolerance: ±10%; Voltage Rated: 50V; Temperature Coefficient: X7R
C15 = CL10A105KB8NNNC: 容值:1uF;精度:±10%;额定电压:50V;材质(温度系数):X5R;; LCSC Part Name: 1uF ±10% 50V; Supplier Part: C15849; Manufacturer: SAMSUNG(三星); Supplier Footprint: 0603; JLCPCB Part Class: 基础库; Datasheet: https://atta.szlcsc.com/upload/public/pdf/source/20160103/1457707679084.pdf; Supplier: LCSC; Tolerance: ±10%; Voltage Rated: 50V; Temperature Coefficient: X5R
CAR_IN = ZX-VH3.96-3PZZ: 插针结构:1x3P;间距:3.96mm;安装方式:直插;参考系列:VH;总PIN数:3P;排数:1;每排PIN数:3;行距:-;额定电流:3A;触头材质:黄铜;触头镀层:锡;工作温度范围:-;; LCSC Part Name: 1x3P 间距:3.96mm 直插 系列:VH; Supplier Part: C7429661; Manufacturer: Megastar(兆星); Supplier Footprint: 插件,P=3.96mm; JLCPCB Part Class: 扩展库; Datasheet: https://atta.szlcsc.com/upload/public/pdf/source/20230619/665D90E085E5CFCDC5B674AE560E2F18.pdf; Supplier: LCSC; Pins Structure: 1x3P; Pitch: 3.96mm; Mounting Type: 直插; Reference Series: VH; Number of Pins: 3P; Number of Rows: 1; Number of PINs Per Row: 3; Current Rating: 3A; Contact Material: 黄铜; Contact Plating: 锡; Voltage Rating: 250V; Plastic Material: PA66; Flame Retardant Rating: UL94V-0; Color: 白色; X-Length of Bottom Edge on Board (Spacing Line): 11.88mm; Y-Width of Bottom Edge on Board: 7.9mm
D1 D8 = 1N4001W_C18199085: 二极管配置:独立式;正向压降(Vf):1V@1.0A;直流反向耐压(Vr):50V;整流电流:1A;; Supplier Part: C18199085; Manufacturer: 宏迦橙; Supplier Footprint: SOD-123FL; JLCPCB Part Class: Extended Part; Datasheet: https://atta.szlcsc.com/upload/public/pdf/source/20230925/B0AB2B510D392D7083D021E804ED238F.pdf; Supplier: LCSC; Diode Configuration: 独立式; Forward Voltage (Vf@If): 1V@1.0A; Reverse Voltage (Vr): 50V; Rectified Current: 1A; Reverse Leakage Current (Ir): 2uA@50V
D2 = ST2045: 二极管配置:独立式;正向压降(Vf):470mV@20A;直流反向耐压(Vr):45V;整流电流:20A;; LCSC Part Name: 电压:45V 电流:20A; Supplier Part: C840773; Manufacturer: MDD(辰达半导体); Supplier Footprint: TO-277; JLCPCB Part Class: 扩展库; Datasheet: https://atta.szlcsc.com/upload/public/pdf/source/20230823/AF175CF7AC4404A9820502D8CEF6FF23.pdf; Supplier: LCSC; Diode Configuration: 独立式; Forward Voltage (Vf@If): 470mV@20A; Reverse Voltage (Vr): 45V; Rectified Current: 20A; Reverse Leakage Current (Ir): 35uA@45V
D3 D4 D6 = SMAJ15A_C148216: 反向截止电压(Vrwm):15V;最大钳位电压:24.4V;峰值脉冲电流(Ipp):16.4A;峰值脉冲功率(Ppp):400W;击穿电压:16.7V;; LCSC Part Name: 单向TVS 15V截止 16.4A峰值脉冲; Supplier Part: C148216; Manufacturer: Littelfuse(美国力特); Supplier Footprint: SMA(DO-214AC); JLCPCB Part Class: Extended Part; Datasheet: https://atta.szlcsc.com/upload/public/pdf/source/20190402/C374025_5ACE77BC72947DF13CF0CBC7F8B57228.pdf; Supplier: LCSC; Reverse Stand-Off Voltage (Vrwm): 15V; Maximum Clamping Voltage: 24.4V; Peak Pulse Current (Ipp): 16.4A; Peak Pulse Power Dissipation (Ppp): 400W; Breakdown Voltage: 16.7V; Type: TVS
D5 = 1N4001_C727079: 二极管配置:独立式;正向压降(Vf):1.1V@1A;直流反向耐压(Vr):50V;整流电流:1A;; Supplier Part: C727079; Manufacturer: TWGMC(台湾迪嘉); Supplier Footprint: SMA(DO-214AC); JLCPCB Part Class: Extended Part; Datasheet: https://atta.szlcsc.com/upload/public/pdf/source/20200828/C727079_3A05254382567072883400655AE0ED46.pdf; Supplier: LCSC; Diode Configuration: 独立式; Forward Voltage (Vf@If): 1.1V@1A; Reverse Voltage (Vr): 50V; Rectified Current: 1A; Reverse Leakage Current (Ir): 5uA
D7 = MMSZ5232BT1G: 二极管配置:独立式;稳压值(标称值):5.6V;稳压值(范围):5.32V~5.88V;功率(Pd):500mW;; Supplier Part: C72743; Manufacturer: onsemi(安森美); Supplier Footprint: SOD-123; Datasheet: https://atta.szlcsc.com/upload/public/pdf/source/20181108/C327525_8597088E8B1A88D8868B9156051B8376.pdf; Supplier: LCSC; Diode Configuration: 独立式; Zener Voltage (Nom): 5.6V; Reverse Leakage Current (Ir): 5uA@3V; Zener Voltage (Range): 5.32V~5.88V; Power Dissipation: 500mW; Zener Impedance (Zzt): 11Ω
D9 = SMAJ3.3A_C18199544: 极性:单向;反向截止电压(Vrwm):3.3V;钳位电压:8.7V@47.6A;峰值脉冲电流(Ipp):47.6A;峰值脉冲功率(Ppp):400W;击穿电压:4.2V;; Supplier Part: C18199544; Manufacturer: BORN(伯恩半导体); Supplier Footprint: SMA; JLCPCB Part Class: Extended Part; Datasheet: https://atta.szlcsc.com/upload/public/pdf/source/20230925/425256E1AD6CFD81E8F71F887015A008.pdf; Supplier: LCSC; Polarity: 单向; Reverse Stand-Off Voltage (Vrwm): 3.3V; Clamping Voltage: 8.7V@47.6A; Peak Pulse Current (Ipp): 47.6A; Peak Pulse Power Dissipation (Ppp): 400W; Voltage - Breakdown: 4.2V; Reverse Leakage Current (Ir): 150uA; Type: TVS
D10 = SMAJ5.0A_C19077523: 极性:单向;反向截止电压(Vrwm):5V;钳位电压:9.2V;峰值脉冲电流(Ipp):43.5A;峰值脉冲功率(Ppp):400W;击穿电压:6.4V;; Supplier Part: C19077523; Manufacturer: 宏嘉诚; Supplier Footprint: SMA; JLCPCB Part Class: Extended Part; Datasheet: https://atta.szlcsc.com/upload/public/pdf/source/20250107/539D2DC1EE5F9F3FCEFE35DA61E92AD9.pdf; Supplier: LCSC; Polarity: 单向; Reverse Stand-Off Voltage (Vrwm): 5V; Clamping Voltage: 9.2V; Peak Pulse Current (Ipp): 43.5A; Peak Pulse Power Dissipation (Ppp): 400W; Voltage - Breakdown: 6.4V; Reverse Leakage Current (Ir): 800uA; Number of Channels: 单路; Type: TVS
DC1 = DC-044A-20A: 触点内径:2mm;触点外径:0.9mm;; LCSC Part Name: DC座内铁芯2.011.6mm*10.1mm; Supplier Part: C129006; Manufacturer: 韩国韩荣; Supplier Footprint: ThroughHole; JLCPCB Part Class: ExtendedPart; Datasheet: https://atta.szlcsc.com/upload/public/pdf/source/20210810/C8974B0AB7FDF70EB0A74D74746E6460.pdf; Supplier: LCSC; Inside Contact Diameter: 2mm; Outside Contact Diameter: 0.9mm
FH1 = 01550900M: 保险丝座类型:-;保险丝类型:-;保险丝尺寸:-;; Supplier Part: C108518; Manufacturer: Littelfuse(美国力特); Supplier Footprint: SMD,9.73x5.03mm; JLCPCB Part Class: ExtendedPart; Datasheet: https://atta.szlcsc.com/upload/public/pdf/source/20180709/C108518_633006668DA33DEF5C52F8FE2F1C83D6.pdf; Supplier: LCSC
L1 = FXL0630-3R3-M: 电感值:3.3uH;精度:±20%;额定电流:8.5A;饱和电流(Isat):9.5A;类型:一体成型电感;; LCSC Part Name: 3.3uH ±20% 9.5A; Supplier Part: C167219; Manufacturer: cjiang(长江微电); Supplier Footprint: SMD,6.6x7mm; JLCPCB Part Class: 扩展库; Datasheet: https://atta.szlcsc.com/upload/public/pdf/source/20240426/3189EA8206330E2108542F9E34E540E7.pdf; Supplier: LCSC; Tolerance: ±20%; Rated Current: 8.5A; Saturation Current (Isat): 9.5A; DC Resistance (DCR): 22mΩ; Type: 一体成型电感
L2 = FXL0630-6R8-M: 电感值:6.8uH;精度:±20%;额定电流:5A;饱和电流(Isat):6A;类型:一体成型电感;; LCSC Part Name: 6.8uH ±20% 6A; Supplier Part: C167221; Manufacturer: cjiang(长江微电); Supplier Footprint: SMD,6.6x7mm; JLCPCB Part Class: Extended Part; Datasheet: https://atta.szlcsc.com/upload/public/pdf/source/20240426/3189EA8206330E2108542F9E34E540E7.pdf; Supplier: LCSC; Tolerance: ±20%; Rated Current: 5A; Saturation Current (Isat): 6A; DC Resistance (DCR): 48mΩ; Type: 一体成型电感
LED_12V = XL-1608SYGC-06: 发光颜色:普绿/黄绿;主波长:570nm~573nm;色温:2800K~3160K;功率:55mW;安装方式:正贴;; LCSC Part Name: 普绿/黄绿 正贴 色温2800K~3160K; Supplier Part: C965805; Manufacturer: XINGLIGHT(成兴光); Supplier Footprint: 0603; JLCPCB Part Class: 扩展库; Datasheet: https://atta.szlcsc.com/upload/public/pdf/source/20221102/F362183196D461585F90F08511E6DE2E.pdf; Supplier: LCSC; Emitted Color: 普绿/黄绿; Lens Color: 无色透明; Dominant Wavelength: 570nm~573nm; Peak Wavelength: 575nm; Color Temperature: 2800K~3160K; Forward Current: 25mA; Power Dissipation: 55mW; Viewing Angle: 120°; Mounting Sytle: 正贴; Operating Temperature: -30℃~+85℃
Q1 Q2 Q4 = S9013-E: 晶体管类型:NPN;集电极电流(Ic):500mA;集射极击穿电压(Vceo):25V;功率(Pd):300mW;直流电流增益(hFE@Ic,Vce):120@50mA,1V;; LCSC Part Name: NPN 电流:500mA 耐压:25V; Supplier Part: C41371419; Manufacturer: MDD(辰达半导体); Supplier Footprint: SOT-23; JLCPCB Part Class: 扩展库; Datasheet: https://atta.szlcsc.com/upload/public/pdf/source/20241113/4DDBD2B8A7B6A974495B9B970C95E559.pdf; Supplier: LCSC; Transistor Type: NPN; Collector Current (Ic): 500mA; Collector-Emitter Breakdown Voltage (Vceo): 25V; Power Dissipation (Pd): 300mW; DC Current Gain (hFE@Ic,Vce): 120@50mA,1V; Transition Frequency (fT): 150MHz; Collector Cut-Off Current (Icbo): 100nA; Collector-Emitter Saturation Voltage (VCE(sat)@Ic,Ib): 600mV@500mA,50mA; Operating Temperature: -55℃~+150℃
Q3 = AOD409-HXY: 类型:1个P沟道;漏源电压(Vdss):60V;连续漏极电流(Id):50A;导通电阻(RDS(on)):24mΩ@10V,18A;耗散功率(Pd):52.1W;阈值电压(Vgs(th)):1V;; LCSC Part Name: 1个P沟道 耐压:60V 电流:50A; Supplier Part: C6285771; Manufacturer: HXY MOSFET(华轩阳电子); Supplier Footprint: TO-252-2L; JLCPCB Part Class: Extended Part; Datasheet: https://atta.szlcsc.com/upload/public/pdf/source/20230913/E7650BEFEEB409BC10CCB7F56D2AF9B5.pdf; Supplier: LCSC; Type: 1个P沟道; Drain to Source Voltage: 60V; Current - Continuous Drain(Id): 50A; RDS(on): 24mΩ@10V,18A; Pd - Power Dissipation: 52.1W; Gate Threshold Voltage (Vgs(th)@Id): 1V; Input Capacitance(Ciss@Vds): 3.635nF@15V; Reverse Transfer Capacitance (Crss@Vds): 141pF@15V; Operating Temperature: -55℃~+150℃
R1 = FRM121WFR010TM: 电阻类型:采样电阻;阻值:10mΩ;精度:±1%;额定压降:-;功率:1W;温度系数:±50ppm/℃;安装方式:-;; LCSC Part Name: 10mΩ ±1% 1W; Supplier Part: C7467248; Manufacturer: FOJAN(富捷); Supplier Footprint: 1206; JLCPCB Part Class: 扩展库; Datasheet: https://atta.szlcsc.com/upload/public/pdf/source/20240709/7FCE84187288C94C67B1004F90EDDF14.pdf; Supplier: LCSC; Type: 采样电阻; Tolerance: ±1%; Power(Watts): 1W; Temperature Coefficient: ±50ppm/℃
R3 R11 = 0603WAF1003T5E: 电阻类型:厚膜电阻;阻值:100kΩ;精度:±1%;功率:100mW;最大工作电压:75V;温度系数:±100ppm/℃;; LCSC Part Name: 100kΩ ±1% 100mW 厚膜电阻; Supplier Part: C25803; Manufacturer: UNI-ROYAL(厚声); Supplier Footprint: 0603; JLCPCB Part Class: 基础库; Datasheet: https://atta.szlcsc.com/upload/public/pdf/source/20200306/C422600_1E6D84923E4A46A82E41ADD87F860B5C.pdf; Supplier: LCSC; Type: 厚膜电阻; Tolerance: ±1%; Power(Watts): 100mW; Overload Voltage (Max): 75V; Temperature Coefficient: ±100ppm/℃; Operating Temperature Range: -55℃~+155℃
R4 R7 R8 R23-R25 = 0603WAF4701T5E: 电阻类型:厚膜电阻;阻值:4.7kΩ;精度:±1%;功率:100mW;; LCSC Part Name: 4.7kΩ ±1% 100mW; Supplier Part: C23162; Manufacturer: UNI-ROYAL(厚声); Supplier Footprint: 0603; JLCPCB Part Class: Basic Part; Datasheet: https://atta.szlcsc.com/upload/public/pdf/source/20200306/C422600_1E6D84923E4A46A82E41ADD87F860B5C.pdf; Supplier: LCSC; Type: 厚膜电阻; Tolerance: ±1%; Power(Watts): 100mW; Temperature Coefficient: ±100ppm/℃; Overload Voltage (Max): 75V; Operating Temperature Range: -55℃~+155℃
R5 = 3296W-1-103: 阻值:10kΩ;精度:±10%;; LCSC Part Name: 10kΩ ±10%; Supplier Part: C118954; Manufacturer: BOCHEN(博晨); Supplier Footprint: 插件; JLCPCB Part Class: 扩展库; Datasheet: https://atta.szlcsc.com/upload/public/pdf/source/20171114/C118954_15106326646611117443.pdf; Supplier: LCSC; Tolerance: ±10%
R6 = 0603WAF5102T5E: 电阻类型:厚膜电阻;阻值:51kΩ;精度:±1%;功率:100mW;最大工作电压:75V;温度系数:±100ppm/℃;; LCSC Part Name: 51kΩ ±1% 100mW 厚膜电阻; Supplier Part: C23196; Manufacturer: UNI-ROYAL(厚声); Supplier Footprint: 0603; JLCPCB Part Class: Basic Part; Datasheet: https://atta.szlcsc.com/upload/public/pdf/source/20200306/C422600_1E6D84923E4A46A82E41ADD87F860B5C.pdf; Supplier: LCSC; Type: 厚膜电阻; Tolerance: ±1%; Power(Watts): 100mW; Overload Voltage (Max): 75V; Temperature Coefficient: ±100ppm/℃; Operating Temperature Range: -55℃~+155℃
R12 R17 = RT0603BRD07100KL: 电阻类型:薄膜电阻;阻值:100kΩ;精度:±0.1%;功率:100mW;; LCSC Part Name: 100kΩ ±0.1% 100mW; Supplier Part: C122538; Manufacturer: YAGEO(国巨); Supplier Footprint: 0603; JLCPCB Part Class: 扩展库; Datasheet: https://atta.szlcsc.com/upload/public/pdf/source/20170721/C122538_1500619326323834092.pdf; Supplier: LCSC; Type: 薄膜电阻; Tolerance: ±0.1%; Power(Watts): 100mW; Temperature Coefficient: ±25ppm/℃; Overload Voltage (Max): 75V; Operating Temperature Range: -55℃~+155℃
R13 R18 = 0603WAF1802T5E: 电阻类型:厚膜电阻;阻值:18kΩ;精度:±1%;功率:100mW;最大工作电压:75V;温度系数:±100ppm/℃;; LCSC Part Name: 18kΩ ±1% 100mW 厚膜电阻; Supplier Part: C25810; Manufacturer: UNI-ROYAL(厚声); Supplier Footprint: 0603; JLCPCB Part Class: 基础库; Datasheet: https://atta.szlcsc.com/upload/public/pdf/source/20200306/C422600_1E6D84923E4A46A82E41ADD87F860B5C.pdf; Supplier: LCSC; Type: 厚膜电阻; Tolerance: ±1%; Power(Watts): 100mW; Overload Voltage (Max): 75V; Temperature Coefficient: ±100ppm/℃; Operating Temperature Range: -55℃~+155℃
R14 R19 R20 = 0603WAF4022T5E: 电阻类型:厚膜电阻;阻值:40.2kΩ;精度:±1%;功率:100mW;; LCSC Part Name: 40.2kΩ ±1% 100mW; Supplier Part: C12447; Manufacturer: UNI-ROYAL(厚声); Supplier Footprint: 0603; JLCPCB Part Class: Basic Part; Datasheet: https://atta.szlcsc.com/upload/public/pdf/source/20200306/C422600_1E6D84923E4A46A82E41ADD87F860B5C.pdf; Supplier: LCSC; Type: 厚膜电阻; Tolerance: ±1%; Power(Watts): 100mW; Temperature Coefficient: ±100ppm/℃; Overload Voltage (Max): 75V; Operating Temperature Range: -55℃~+155℃
R15 = 0603WAF8871T5E: 电阻类型:厚膜电阻;阻值:8.87kΩ;精度:±1%;功率:100mW;最大工作电压:75V;温度系数:±100ppm/℃;; LCSC Part Name: 8.87kΩ ±1% 100mW 厚膜电阻; Supplier Part: C23248; Manufacturer: UNI-ROYAL(厚声); Supplier Footprint: 0603; JLCPCB Part Class: 扩展库; Datasheet: https://atta.szlcsc.com/upload/public/pdf/source/20200306/C422600_1E6D84923E4A46A82E41ADD87F860B5C.pdf; Supplier: LCSC; Type: 厚膜电阻; Tolerance: ±1%; Power(Watts): 100mW; Overload Voltage (Max): 75V; Temperature Coefficient: ±100ppm/℃; Operating Temperature Range: -55℃~+155℃
R16 = 0603WAF1302T5E: 电阻类型:厚膜电阻;阻值:13kΩ;精度:±1%;功率:100mW;; LCSC Part Name: 13kΩ ±1% 100mW; Supplier Part: C22797; Manufacturer: UNI-ROYAL(厚声); Supplier Footprint: 0603; JLCPCB Part Class: 基础库; Datasheet: https://atta.szlcsc.com/upload/public/pdf/source/20200306/C422600_1E6D84923E4A46A82E41ADD87F860B5C.pdf; Supplier: LCSC; Type: 厚膜电阻; Tolerance: ±1%; Power(Watts): 100mW; Temperature Coefficient: ±100ppm/℃; Overload Voltage (Max): 75V; Operating Temperature Range: -55℃~+155℃
U1 = LM358DT: 放大器数:双路;轨到轨:-;增益带宽积(GBP):800kHz;输入失调电压(Vos):7mV;压摆率(SR):0.6V/us;输入偏置电流(Ib):20nA;; LCSC Part Name: 低功耗双运算放大器，低输入偏置电流; Supplier Part: C9418; Manufacturer: ST(意法半导体); Supplier Footprint: SOIC-8; JLCPCB Part Class: Extended Part; Datasheet: https://atta.szlcsc.com/upload/public/pdf/source/20140724/1457707175115.pdf; Supplier: LCSC; Number of Circuits: 双路; Maximum Power Supply Range (Vdd-Vss): 30V; Gain Bandwidth Product(GBP): 800kHz; Voltage - Input Offset(Vos): 7mV; Input Offset Voltage Drift (Vos TC): 30uV/℃; Slew Rate(SR): 0.6V/us; Current - Input Bias(Ib): 20nA; Noise density(eN): 55nV/√Hz@1kHz; Common Mode Rejection Ratio (CMRR): 85dB; Quiescent Current: 700uA; Output Current: 30mA; Operating Temperature: 0℃~+70℃
U2 = MP2225GJ-Z_C133066: 功能类型:降压型;输出类型:可调;工作电压:4.5V~18V;输出电压:-;输出电流:5A;; LCSC Part Name: 高效率5A 18V同步降压转换器; Supplier Part: C133066; Manufacturer: MPS(芯源); Supplier Footprint: TSOT-23-8; JLCPCB Part Class: 扩展库; Datasheet: https://atta.szlcsc.com/upload/public/pdf/source/20240315/DE01001F1E5BE5D21C887012CE3070B7.pdf; Supplier: LCSC; Function: 降压型; Output Type: 可调; Input Voltage: 4.5V~18V; Output Current: 5A; Switching Frequency: 500kHz; Operating Temperature: -40℃~+125℃; Synchronous Rectification: 是; Number of Outputs: 1; Topology: 降压式; Quiescent Current (Iq): 400uA; Switch tube (built-in/external): 内置
U3 = MT1471: Supplier Part: C2684932; Manufacturer: 西安航天民芯; Supplier Footprint: SOT-23-6; JLCPCB Part Class: 扩展库; Datasheet: https://atta.szlcsc.com/upload/public/pdf/source/20230220/A8FA3B1F5B3CB5F53DE7D888B31C9EA5.pdf; Supplier: LCSC
U4 = INA226AIDGSR: INA226 支持报警功能的 36V、双向、超高精度、低侧/高侧、I2C 输出电流/功率监控器; Supplier Part: C49851; Manufacturer: TI(德州仪器); Supplier Footprint: MSOP-10; JLCPCB Part Class: 扩展库; Datasheet: https://www.ti.com/cn/lit/gpn/ina226; Supplier: LCSC; Supply Voltage: 0V~36V; Operating Temperature: -40℃~+125℃
U5 = AHT20: Supplier Part: C2757850; Manufacturer: 广州奥松; Supplier Footprint: SMD; JLCPCB Part Class: 扩展库; Datasheet: https://atta.szlcsc.com/upload/public/pdf/source/20231023/00557B34ED120268320A4810FF8DED4D.pdf; Supplier: LCSC
C29-C31 = CL10B102KB8NNNC: 容值:1nF;精度:±10%;额定电压:50V;材质(温度系数):X7R;; LCSC Part Name: 1nF ±10% 50V; Supplier Part: C1588; Manufacturer: SAMSUNG(三星); Supplier Footprint: 0603; JLCPCB Part Class: 基础库; Datasheet: https://atta.szlcsc.com/upload/public/pdf/source/20160218/1457707763339.pdf; Supplier: LCSC; Tolerance: ±10%; Voltage Rated: 50V; Temperature Coefficient: X7R
GE_LAN1 GE_LAN2 GE_WAN = HR911130A: 连接器类型:RJ45插座;端口数量:1;屏蔽:-;LED:带LED;等级:-;; LCSC Part Name: 带LED; Supplier Part: C54408; Manufacturer: HANRUN(汉仁); Supplier Footprint: 插件; JLCPCB Part Class: Extended Part; Datasheet: https://atta.szlcsc.com/upload/public/pdf/source/20151014/1457707458393.pdf; Supplier: LCSC; Connector Type: RJ45插座; Number of Ports: 1; LED: 带LED
R39-R44 = 0603WAF1001T5E: 电阻类型:厚膜电阻;阻值:1kΩ;精度:±1%;功率:100mW;最大工作电压:75V;温度系数:±100ppm/℃;; LCSC Part Name: 1kΩ ±1% 100mW 厚膜电阻; Supplier Part: C21190; Manufacturer: UNI-ROYAL(厚声); Supplier Footprint: 0603; JLCPCB Part Class: Basic Part; Datasheet: https://atta.szlcsc.com/upload/public/pdf/source/20200306/C422600_1E6D84923E4A46A82E41ADD87F860B5C.pdf; Supplier: LCSC; Type: 厚膜电阻; Tolerance: ±1%; Power(Watts): 100mW; Overload Voltage (Max): 75V; Temperature Coefficient: ±100ppm/℃; Operating Temperature Range: -55℃~+155℃
CORE1 = HLK-7621_C3029172: 双核千兆5端口/PCIe接口/OpenWrt开发; LCSC Part Name: 千兆路由\openwrt\MT7621; Supplier Part: C3029172; Manufacturer: HI-LINK(海凌科); JLCPCB Part Class: 扩展库; Datasheet: https://atta.szlcsc.com/upload/public/pdf/source/20220608/49527F6EAF84892F4A263E42D8A5D497.pdf; Supplier: LCSC
I2C_1 TTL1 = PZ254V-11-04P: 插针结构:1x4P;间距:2.54mm;行距:-;圆针/方针:方针;安装类型:直插;排数:单排;总PIN位数:4P;额定电流:3A;额定电压:250V;配合针长度:6mm;塑高:2.5mm;端接针长度:3mm;触头材质:-;工作温度范围:-40℃~+105℃;颜色:黑色;; LCSC Part Name: 间距:2.54mm 1x4P 直插 方针; Supplier Part: C2691448; Manufacturer: XFCN(兴飞); Supplier Footprint: 插件,P=2.54mm; JLCPCB Part Class: 扩展库; Datasheet: https://atta.szlcsc.com/upload/public/pdf/source/20200309/C492403_F9F19131791D08044AD4F84F8E751A34.pdf; Supplier: LCSC; Pin Structure: 1x4P; Pitch: 2.54mm; Circluar Pins/Square Pins: 方针; Mounting Type: 直插; Number of Rows: 单排; Number of Pins: 4P; Current Rating (Max): 3A; Voltage Rating (Max): 250V; Length of Mating Pin: 6mm; Insulation Height: 2.5mm; Length of End Connection Pin: 3mm; Operating Temperature Range: -40℃~+105℃; Color: 黑色
TP1 TP2 = Test-Point: Test Point 测试点
TTL2 = HX PZ2.0-1x4P ZZ: 插针结构:1x4P;间距:2mm;行距:-;圆针/方针:方针;安装方式:直插;排数:单排;总PIN位数:4P;额定电流:1.5A;额定电压:-;配合针长度:3.9mm;塑高:2mm;端接针长度:2.8mm;触头材质:磷青铜;触头镀层:金;工作温度:-40℃~+105℃;颜色:黑色;; LCSC Part Name: 1x4P 间距:2mm 方针 直插; Supplier Part: C22438287; Manufacturer: hanxia(韩下); Supplier Footprint: 插件,P=2mm; JLCPCB Part Class: Extended Part; Datasheet: https://atta.szlcsc.com/upload/public/pdf/source/20240522/4041CF8381B23872C6D86DE397775C63.pdf; Supplier: LCSC; Pin Structure: 1x4P; Pitch: 2mm; Circluar Pins/Square Pins: 方针; Mounting Type: 直插; Number of Rows: 单排; Number of Pins: 4P; Current Rating: 1.5A; Length of Mating Pin: 3.9mm; Insulation Height: 2mm; Length of End Connection Pin: 2.8mm; Contact Material: 磷青铜; Contact Plating: 金; Operating Temperature: -40℃~+105℃; Color: 黑色

## Nets
3.3V: C10.1 C11.1 C12.1 C13.1 C22.1 C23.1 C24.1 CORE1.1(3.3VD) CORE1.2(3.3VD) CORE1.3(3.3VD) CORE1.4(3.3VD) D9.1 F1.1 F2.1 GE_LAN1.11 GE_LAN1.14 GE_LAN2.11 GE_LAN2.14 GE_WAN.11 GE_WAN.14 L1.2 PCIE1.2(+3.3Vaux) PCIE1.24(+3.3Vaux) PCIE1.52(+3.3Vaux) PCIE2.2(+3.3Vaux) PCIE2.24(+3.3Vaux) PCIE2.52(+3.3Vaux) R14.1 R22.2 R24.2 R25.2 R27.2 R28.2 R35.1 TTL1.1 WWAN1.2(3.3V) WWAN1.4(3.3V) WWAN1.70(3.3V) WWAN1.72(3.3V) WWAN1.74(3.3V)
5V: C16.1 C17.2 C19.1 D10.1(K) F3.1 L2.2 R20.2 R29.1 R30.1 R32.1 R33.1
12V: C3.1 C7.1 C8.1 C18.1 C20.1 D4.1(C) D8.2(A) FH1.2 Q3.2(D) R2.1 R12.2 R17.1 U2.2(IN) U3.3(VIN)
12V_SIG: C1.1 D1.1(K) R5.1
GND: 12VOUT1.2 C1.2 C2.2 C3.2 C4.1 C5.1 C6.1 C7.2 C8.2 C10.2 C11.2 C12.2 C14.1 C16.2 C17.1 C18.2 C19.2 C20.2 C21.2 C22.2 C23.2 C24.2 C25.2 C26.1 C27.2 C28.2 C29.2 C30.2 C31.2 CAR_IN.3 CORE1.5(GND) CORE1.6(GND) CORE1.7(GND) CORE1.8(GND) CORE1.19(GND) CORE1.24(GND) CORE1.27(GND) CORE1.44(GND) CORE1.53(GND) CORE1.62(GND) CORE1.92(GND) CORE1.119(GND) CORE1.125(GND) D3.2(A) D4.2(A) D6.2(A) D7.2(A) D9.2 D10.2(A) DC1.2 DC1.3 DC1.4 DC1.5 GE_LAN1.P10 GE_LAN1.SHIELD0 GE_LAN1.SHIELD1 GE_LAN2.P10 GE_LAN2.SHIELD0 GE_LAN2.SHIELD1 GE_WAN.P10 GE_WAN.SHIELD0 GE_WAN.SHIELD1 I2C_1.2 LED_12V.1(K) PCIE1.4(GND) PCIE1.9(GND) PCIE1.15(GND) PCIE1.21(GND) PCIE1.26(GND) PCIE1.27(GND) PCIE1.29(GND) PCIE1.34(GND) PCIE1.35(GND) PCIE1.37(GND) PCIE1.40(GND) PCIE1.43(GND) PCIE1.50(GND) PCIE1.S PCIE2.4(GND) PCIE2.9(GND) PCIE2.15(GND) PCIE2.21(GND) PCIE2.26(GND) PCIE2.27(GND) PCIE2.29(GND) PCIE2.34(GND) PCIE2.35(GND) PCIE2.37(GND) PCIE2.40(GND) PCIE2.43(GND) PCIE2.50(GND) PCIE2.S Q1.2(E) Q2.2(E) Q4.2(E) R3.1 R5.3 R13.2 R15.1 R16.1 R18.1 R38.2 SIM1.8 SIM1.9 SIM1.10 SIM1.11 SIM1.C5(GND) TP1.1 TTL1.2 TTL2.2 U1.4(V-) U2.1(AGND) U2.4(GND) U3.1(GND) U4.1(A1) U4.2(A0) U4.7(GND) U5.5(GND) U6.2 U7.2 USB1.4 WWAN1.3(GND) WWAN1.5(GND) WWAN1.11(GND) WWAN1.27(GND) WWAN1.33(GND) WWAN1.39(GND) WWAN1.45(GND) WWAN1.51(GND) WWAN1.57(GND) WWAN1.71(GND) WWAN1.73(GND) WWAN1.S
CAR_12VIN: C2.1 D2.2(K) D3.1(C) Q3.3(S) R4.1 R11.1 U1.8(V+)
CAR_ACC: C4.2 D5.1(K) D6.1(C) R3.2 R8.1 R26.1
ESW_P0_A_TXV+: CORE1.28(ESW_TXVP_A_P0)
ESW_P0_A_TXV-: CORE1.29(ESW_TXVN_A_P0)
ESW_P0_B_TXV+: CORE1.30(ESW_TXVP_B_P0)
ESW_P0_B_TXV-: CORE1.31(ESW_TXVN_B_P0)
ESW_P0_C_TXV+: CORE1.32(ESW_TXVP_C_P0)
ESW_P0_C_TXV-: CORE1.33(ESW_TXVN_C_P0)
ESW_P0_D_TXV+: CORE1.34(ESW_TXVP_D_P0)
ESW_P0_D_TXV-: CORE1.35(ESW_TXVN_D_P0)
ESW_P1_A_TXV+: CORE1.36(ESW_TXVP_A_P1) GE_LAN1.P2(MDI0+)
ESW_P1_A_TXV-: CORE1.37(ESW_TXVN_A_P1) GE_LAN1.P3(MDI0-)
ESW_P1_B_TXV+: CORE1.38(ESW_TXVP_B_P1) GE_LAN1.P4(MDI1+)
ESW_P1_B_TXV-: CORE1.39(ESW_TXVN_B_P1) GE_LAN1.P7(MDI1-)
ESW_P1_C_TXV+: CORE1.40(ESW_TXVP_C_P1) GE_LAN1.P5(MDI2+)
ESW_P1_C_TXV-: CORE1.41(ESW_TXVN_C_P1) GE_LAN1.P6(MDI2-)
ESW_P1_D_TXV+: CORE1.42(ESW_TXVP_D_P1) GE_LAN1.P8(MDI3+)
ESW_P1_D_TXV-: CORE1.43(ESW_TXVN_D_P1) GE_LAN1.P9(MDI3-)
ESW_P2_A_TXV+: CORE1.45(ESW_TXVP_A_P2) GE_LAN2.P2(MDI0+)
ESW_P2_A_TXV-: CORE1.46(ESW_TXVN_A_P2) GE_LAN2.P3(MDI0-)
ESW_P2_B_TXV+: CORE1.47(ESW_TXVP_B_P2) GE_LAN2.P4(MDI1+)
ESW_P2_B_TXV-: CORE1.48(ESW_TXVN_B_P2) GE_LAN2.P7(MDI1-)
ESW_P2_C_TXV+: CORE1.49(ESW_TXVP_C_P2) GE_LAN2.P5(MDI2+)
ESW_P2_C_TXV-: CORE1.50(ESW_TXVN_C_P2) GE_LAN2.P6(MDI2-)
ESW_P2_D_TXV+: CORE1.51(ESW_TXVP_D_P2) GE_LAN2.P8(MDI3+)
ESW_P2_D_TXV-: CORE1.52(ESW_TXVN_D_P2) GE_LAN2.P9(MDI3-)
ESW_P3_A_TXV+: CORE1.54(ESW_TXVP_A_P3)
ESW_P3_A_TXV-: CORE1.55(ESW_TXVN_A_P3)
ESW_P3_B_TXV+: CORE1.56(ESW_TXVP_B_P3)
ESW_P3_B_TXV-: CORE1.57(ESW_TXVN_B_P3)
ESW_P3_C_TXV+: CORE1.58(ESW_TXVP_C_P3)
ESW_P3_C_TXV-: CORE1.59(ESW_TXVN_C_P3)
ESW_P3_D_TXV+: CORE1.60(ESW_TXVP_D_P3)
ESW_P3_D_TXV-: CORE1.61(ESW_TXVN_D_P3)
ESW_P4_A_TXV+: CORE1.63(ESW_TXVP_A_P4) GE_WAN.P2(MDI0+)
ESW_P4_A_TXV-: CORE1.64(ESW_TXVN_A_P4) GE_WAN.P3(MDI0-)
ESW_P4_B_TXV+: CORE1.65(ESW_TXVP_B_P4) GE_WAN.P4(MDI1+)
ESW_P4_B_TXV-: CORE1.66(ESW_TXVN_B_P4) GE_WAN.P7(MDI1-)
ESW_P4_C_TXV+: CORE1.67(ESW_TXVP_C_P4) GE_WAN.P5(MDI2+)
ESW_P4_C_TXV-: CORE1.68(ESW_TXVN_C_P4) GE_WAN.P6(MDI2-)
ESW_P4_D_TXV+: CORE1.69(ESW_TXVP_D_P4) GE_WAN.P8(MDI3+)
ESW_P4_D_TXV-: CORE1.70(ESW_TXVN_D_P4) GE_WAN.P9(MDI3-)
GPIO13: CORE1.121(JTDO) R39.2
GPIO14: CORE1.122(JTDI) R41.2
GPIO15: CORE1.120(JTMS) R43.1
GPIO16: CORE1.124(JTCLK) Q4.3(C) R27.1
GPIO17: CORE1.123(JTRST_N) R28.1
I2C_SCL: CORE1.96(I2C_SCLK) I2C_1.4 R25.1 U4.5(SCL) U5.3(SCL)
I2C_SDA: CORE1.97(I2C_SD) I2C_1.3 R24.1 U4.4(SDA) U5.4(SDA)
LED_P0: CORE1.75(ESW_P0_LED_0)
LED_P1: CORE1.74(ESW_P1_LED_0) R40.2
LED_P2: CORE1.73(ESW_P2_LED_0) R42.2
LED_P3: CORE1.72(ESW_P3_LED_0)
LED_P4: CORE1.71(ESW_P4_LED_0) R44.2
LED_WLAN1: PCIE1.44(~LED_WLAN)
LED_WLAN2: PCIE2.44(~LED_WLAN)
LED_WWAN: WWAN1.10(GPIO_9/DAS/DSS)
PCIE0_REFCLK+: CORE1.117(PCIE_CKP0) PCIE1.13(RefClk+)
PCIE0_REFCLK-: CORE1.118(PCIE_CKN0) PCIE1.11(RefClk-)
PCIE0_RX+: CORE1.114(PCIE_RXN0) PCIE1.25(PERp0)
PCIE0_RX-: CORE1.113(PCIE_RXP0) PCIE1.23(PERn0)
PCIE0_TX+: CORE1.116(PCIE_TXP0) PCIE1.33(PETp0)
PCIE0_TX-: CORE1.115(PCIE_TXN0) PCIE1.31(PETn0)
PCIE1_REFCLK+: CORE1.111(PCIE_CKP1) PCIE2.13(RefClk+)
PCIE1_REFCLK-: CORE1.110(PCIE_CKN1) PCIE2.11(RefClk-)
PCIE1_RX+: CORE1.108(PCIE_RXP1) PCIE2.25(PERp0)
PCIE1_RX-: CORE1.109(PCIE_RXN1) PCIE2.23(PERn0)
PCIE1_TX+: CORE1.106(PCIE_TXP1) PCIE2.33(PETp0)
PCIE1_TX-: CORE1.107(PCIE_TXN1) PCIE2.31(PETn0)
PCIE2_REFCLK+: CORE1.103(PCIE_CKP2) WWAN1.55(REFCLK+)
PCIE2_REFCLK-: CORE1.102(PCIE_CKN2) WWAN1.53(REFCLK-)
PCIE2_RX+: CORE1.100(PCIE_RXN2) WWAN1.43(RX0p/SATA_B-)
PCIE2_RX-: CORE1.101(PCIE_RXP2) WWAN1.41(RX0n/SATA_B+)
PCIE2_TX+: CORE1.98(PCIE_TXN2) WWAN1.49(TX0p/SATA_A+)
PCIE2_TX-: CORE1.99(PCIE_TXP2) WWAN1.47(TX0n/SATA_A-)
PERST: CORE1.105(PERST_N) R31.2 R34.2 R36.2
RST_BTN: CORE1.112(WDT_RST_N) TP2.1
SENSE_V+: CAR_IN.1 DC1.1 R1.2 U4.10(VIN+)
SENSE_V-: D1.2(A) D2.1(A) D2.3(A) R1.1 U4.8(VBUS) U4.9(VIN-)
SERIAL_RXD1: CORE1.93(RXD1) R23.1
SERIAL_RXD2: CORE1.11(RXD2) TTL2.3
SERIAL_RXD3: CORE1.13(RXD3)
SERIAL_TXD1: CORE1.94(TXD1) TTL1.4
SERIAL_TXD2: CORE1.10(TXD2) TTL2.4
SERIAL_TXD3: CORE1.12(TXD3)
UIM_CLK: C28.1 SIM1.C3(CLK) U6.4 WWAN1.32(UIM_CLK)
UIM_DAT: C27.1 R37.1 SIM1.C7(I/O) U6.6 WWAN1.34(UIM_DATA)
UIM_DET: R38.1 SIM1.CD U6.3 WWAN1.66(SIM_DETCET)
UIM_PWR: C25.1 R37.2 SIM1.C1(VCC) WWAN1.36(UIM_PWR)
UIM_RST: C26.2 SIM1.C2(RST) U6.1 WWAN1.30(UIM_RESET)
USB3_DM: CORE1.26(USB_DM_P0) L3.3
USB3_DP: CORE1.25(USB_DP_P0) L3.4
USB3_RX+: CORE1.22(SSUSB_RXP)
USB3_RX-: CORE1.23(SSUSB_RXN)
USB3_TX+: CORE1.20(SSUSB_TXP)
USB3_TX-: CORE1.21(SSUSB_TXN)
USB_LTE_DM: CORE1.18(USB_DM_1P) WWAN1.9(USB_D-)
USB_LTE_DP: CORE1.17(USB_DP_1P) WWAN1.7(USB_D+)
USBPORT_DM: L3.2 U7.3 USB1.2
USBPORT_DP: L3.1 U7.4 USB1.3
$1N5779: R17.2 R18.2 U3.5(EN)
$1N5780: R21.2 U3.6(BS)
$1N5781: R19.2 U3.4(FB)
$1N5784: R16.2 R19.1 R20.1
$1N5786: C15.2 R21.1
$1N5787: C15.1 L2.1 U3.2(SW)
$1N15270: 12VOUT1.1 FH1.1
$1N16726: LED_12V.2(A) R2.2
$1N19096: D7.1(K) R4.2 U1.2(-IN)
$1N19099: C5.2 R5.2 R6.1 U1.3(+IN)
$1N19100: R7.1 U1.1(OUT)
$1N19101: Q1.1(B) R7.2
$1N23103: C6.2 Q3.1(G) R9.1 R10.2 R11.2
$1N23613: CAR_IN.2 D5.2(A)
$1N26662: Q2.1(B) R8.2
$1N26941: Q1.3(C) R9.2
$1N26980: Q2.3(C) R10.1
$1N27764: C14.2 U2.7(VCC)
$1N27807: R12.1 R13.1 U2.6(EN/SYNC)
$1N27948: C9.2 L1.1 U2.3(SW)
$1N28127: C9.1 U2.5(BST)
$1N28466: C13.2 R14.2 R15.2 U2.8(FB)
$1N43921: D8.1(K) R6.2
$1N46222: C21.1 R22.1 U4.6(VS+) U5.2(VDD)
$2N1163: R23.2 TTL1.3
$2N2937: Q4.1(B) R26.2
$2N3184: F2.2 TTL2.1
$2N4030: F1.2 I2C_1.1
$3N1265: PCIE1.49(+5V) PCIE1.51(+5V) R29.2
$3N1269: PCIE1.45(+5V) PCIE1.47(+5V) R30.2
$3N1274: PCIE2.49(+5V) PCIE2.51(+5V) R32.2
$3N1278: PCIE2.45(+5V) PCIE2.47(+5V) R33.2
$3N1798: PCIE1.22(~PERST) R31.1
$3N2079: PCIE2.22(~PERST) R34.1
$4N401: R35.2 WWAN1.6(FULL_CARD_POWER_OFF#)
$4N1720: R36.1 WWAN1.50(PERST#)
$4N4273: F3.2 USB1.1
$5N599: GE_LAN1.12 R40.1
$5N727: C29.1 GE_LAN1.P1
$5N1473: GE_LAN2.12 R42.1
$5N1492: C30.1 GE_LAN2.P1
$5N2126: GE_WAN.12 R44.1
$5N2145: C31.1 GE_WAN.P1
$5N2724: GE_LAN2.13 R41.1
$5N2734: GE_LAN1.13 R39.1
$5N2946: GE_WAN.13 R43.2

Not connected (* = marked no-connect by the designer): CORE1 9(CTS3_N) 14(RTS2_N) 15(CTS2_N) 16(RTS3_N) 76(ESW_DTEST) 77(GE2_TXD3) 78(GE2_TXD2) 79(GE2_TXD1) 80(GE2_TXD0) 81(ESW_DBG_B) 82(MDIO) 83(MDC) 84(GE2_TXEN) 85(GE2_TXCLK) 86(GE2_RXD3) 87(GE2_RXD2) 88(GE2_RXD1) 89(GE2_RXD0) 90(GE2_RXDV) 91(GE2_RXCLK) 95(PORST_N) 104(GPIO0) 126(ND_D7) 127(ND_D6) 128(ND_D5) 129(ND_D4) 130(ND_D3) 131(ND_D2) 132(ND_D1) 133(ND_D0) 134(ND_RB_N) 135(ND_RE_N) 136(ND_CS_N) 137(ND_CLE) 138(ND_ALE) 139(ND_WE_N) 140(ND_WP); PCIE1 1(~WAKE) 3(COEX1) 5(COEX2) 6(+1.5V) 7(~CLKREQ) 8(UIM_PWR) 10(UIM_DATA) 12(UIM_CLK) 14(UIM_RESET) 16(UIM_VPP) 17(UIM_C8) 18(GND) 19(UIM_C4) 20(~W_DISABLE) 28(+1.5V) 30(SMB_CLK) 32(SMB_DATA) 36(USB_D-) 38(USB_D+) 39(+3.3Aux) 41(+3.3Aux) 42(~LED_WWAN) 46(~LED_WPAN) 48(+1.5V); PCIE2 1(~WAKE) 3(COEX1) 5(COEX2) 6(+1.5V) 7(~CLKREQ) 8(UIM_PWR) 10(UIM_DATA) 12(UIM_CLK) 14(UIM_RESET) 16(UIM_VPP) 17(UIM_C8) 18(GND) 19(UIM_C4) 20(~W_DISABLE) 28(+1.5V) 30(SMB_CLK) 32(SMB_DATA) 36(USB_D-) 38(USB_D+) 39(+3.3Aux) 41(+3.3Aux) 42(~LED_WWAN) 46(~LED_WPAN) 48(+1.5V); SIM1 C6(VPP); U1 5(+IN) 6(-IN) 7(OUT); U4 3(Alert); U5 1(NC) 6(NC); U6 5; U7 1 5 6; WWAN1 1(CONFIG_3) 8(W_DISABLE#) 20(GPIO_5) 21(CONFIG_0) 22(GPIO_6) 23(GPIO_11) 24(GPIO_7) 25(DPR) 26(GPIO_10) 28(GPIO_8) 29(RX1n/USB3_RXn) 31(RX1P/USB3_RXp) 35(TX1n/USB3_TXn) 37(TX1p/USB3_TXp) 38(DEVSLP) 40(SCL/GPIO_0) 42(SDA/GPIO_1) 44(ALERT#/GPIO_2) 46(GPIO_3) 48(GPIO_4) 52(CLKREQ#) 54(PEWAKE#) 56(MGF1/NC) 58(MFG2/NC) 59(ANTCTL0) 60(COEX3) 61(ANTCTL1) 62(COEX_TXD/COEX2) 63(ANTCTL2) 64(COEX_RXD/COEX1) 65(ANTCTL3) 67(RESET#) 68(SUSCLK) 69(CONFIG_1) 75(CONFIG_2)

## Notes on the sheets
sheet 1
- Ven=1.4V
  约9V关断
